# Altium project ART-Pi_STM32H750_COPY.PrjPcb (part 1 of 2)
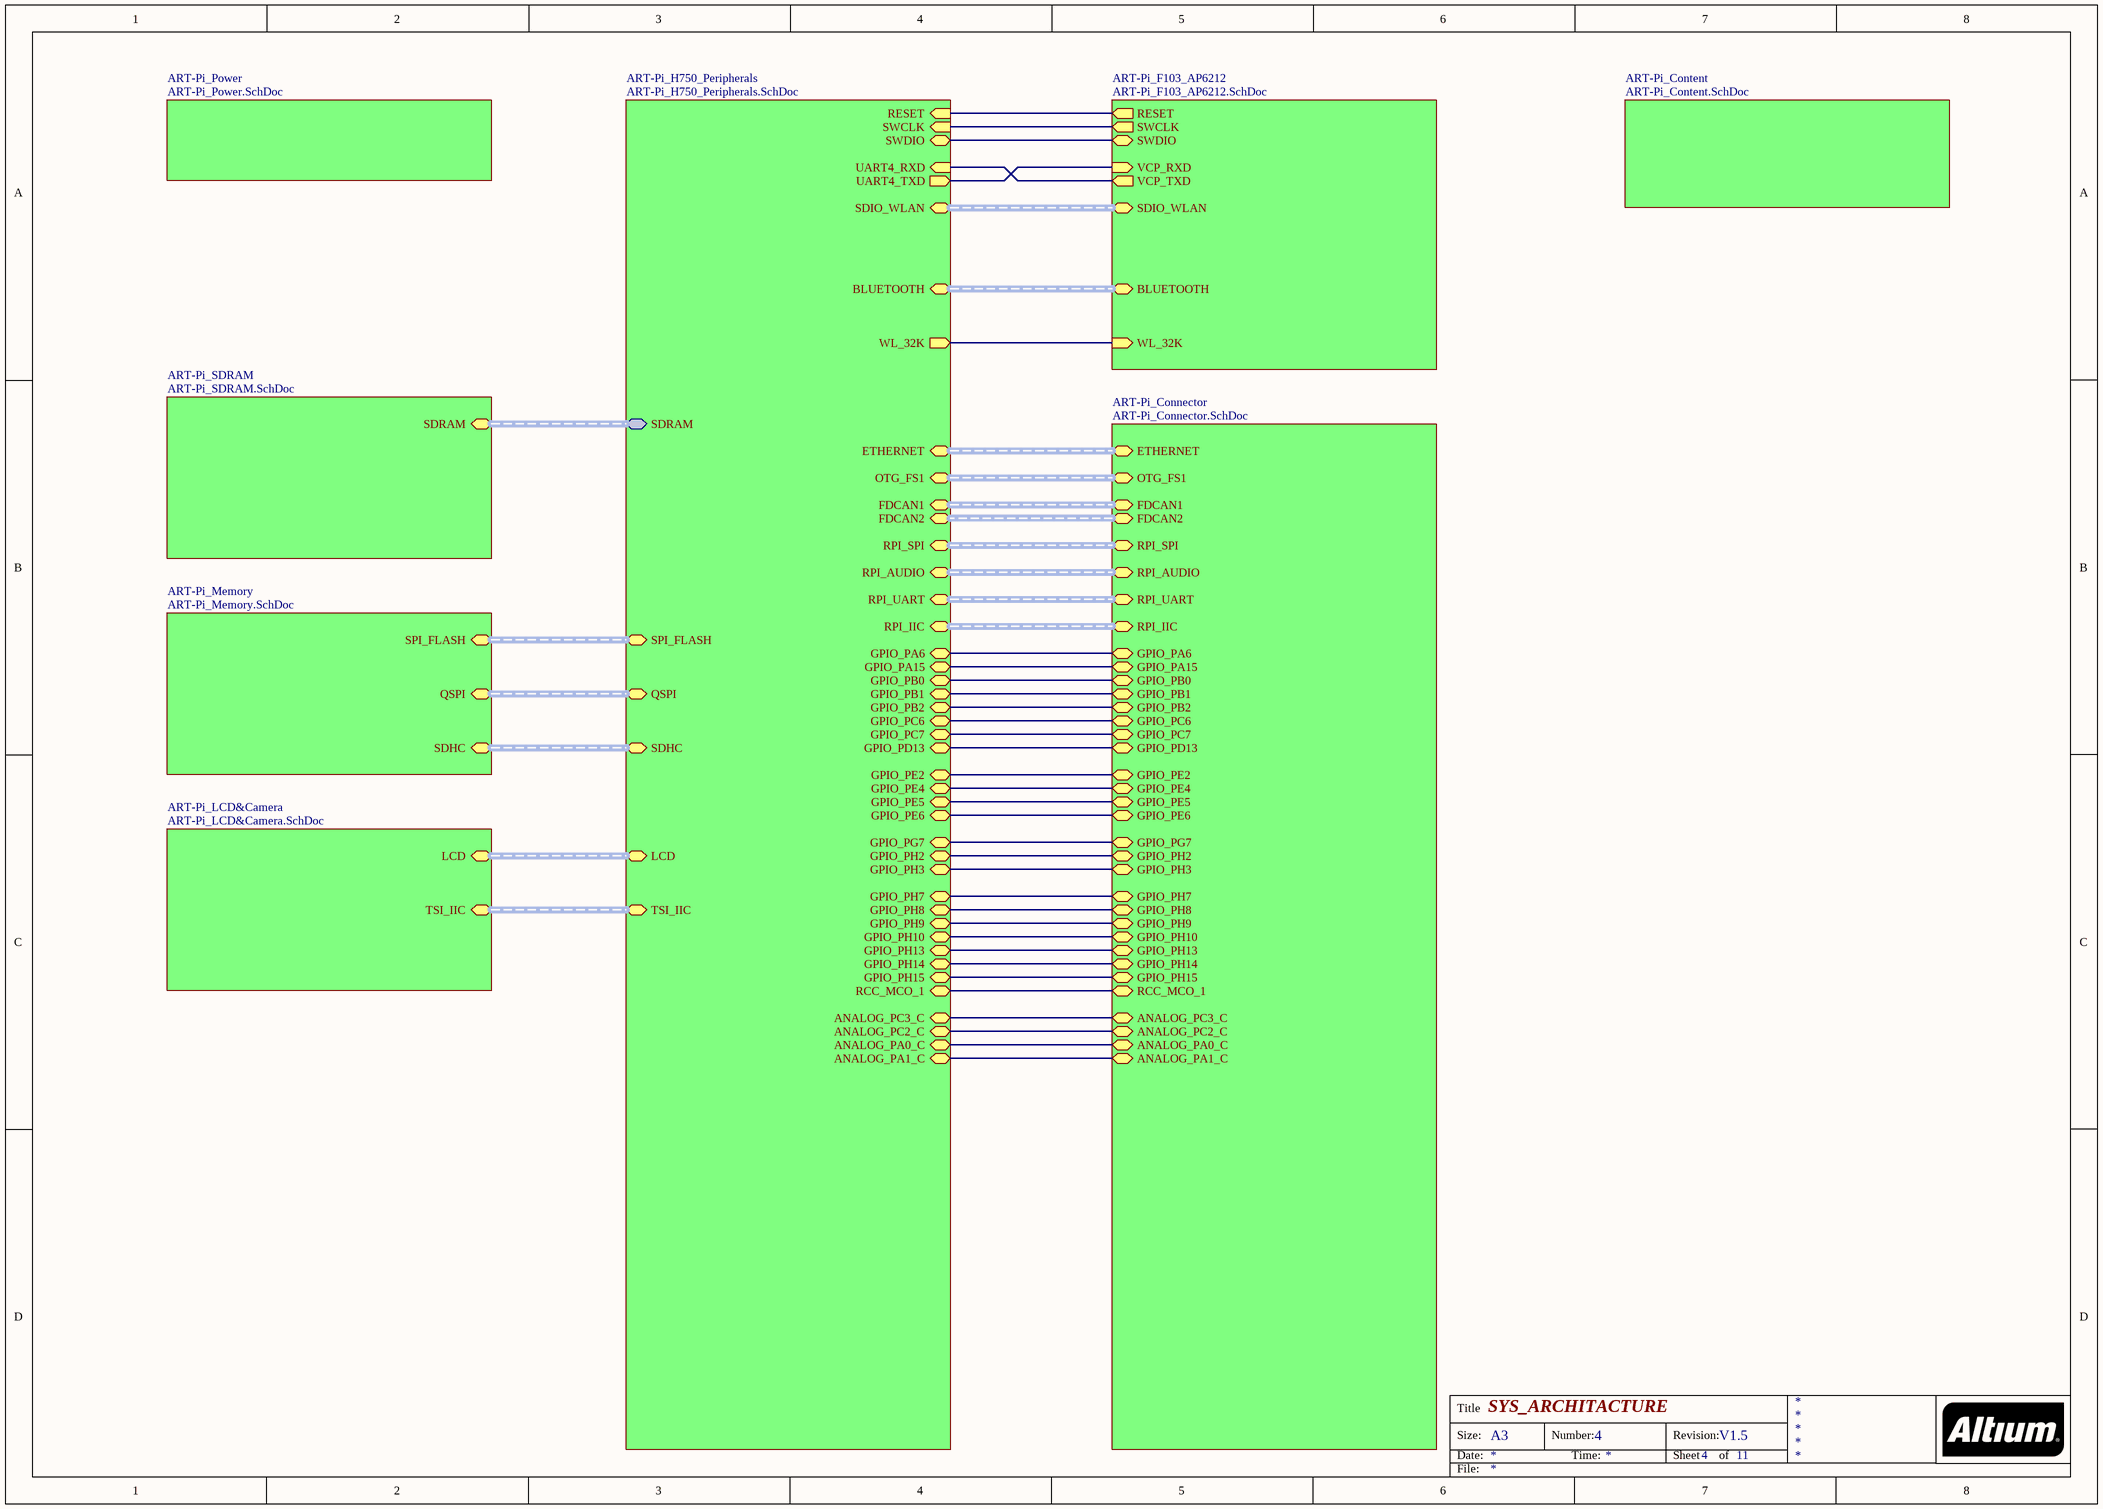
[diagram p0: SYS_ARCHITACTURE.SchDoc]
9 sheets, 195 parts. Net scope: global (net labels, ports and power ports of the same name join across sheets).
Board file: ART-Pi_STM32H750_COPY.PcbDoc
Sheets:
  SYS_ARCHITACTURE.SchDoc
    ART-Pi_Power = ART-Pi_Power.SchDoc
    ART-Pi_SDRAM = ART-Pi_SDRAM.SchDoc
    ART-Pi_Memory = ART-Pi_Memory.SchDoc
    ART-Pi_LCD&Camera = ART-Pi_LCD&Camera.SchDoc
    ART-Pi_H750_Peripherals = ART-Pi_H750_Peripherals.SchDoc
    ART-Pi_F103_AP6212 = ART-Pi_F103_AP6212.SchDoc
    ART-Pi_Content = ART-Pi_Content.SchDoc
    ART-Pi_Connector = ART-Pi_Connector.SchDoc

## Sheet SYS_ARCHITACTURE.SchDoc: SYS_ARCHITACTURE
size A3; DocumentNumber: 4; Revision: V1.5; SheetNumber: 4; SheetTotal: 11; PageSetup: Record=PageOptions|CenterHorizontal=True|CenterVertical=True|PrintScale=1.01|XCorrection=1.00|YCorrection=1.00|PrintKind=0|BorderSize=5000000|LeftOffset=0|BottomOffset=0|Orientation=2|PaperLength=1000|PaperWidth=1000|Scale=100|PaperSource=7|PrintQuality=600|MediaType=1|DitherType=10|PrintScaleMode=1|PaperKind=A3(297x420mm)|PaperIndex=8

### Sub-sheets
ART-Pi_Connector = ART-Pi_Connector.SchDoc: OTG_FS1 (harness Harness), FDCAN1 (harness Harness), FDCAN2 (harness Harness), RPI_SPI (harness Harness), RPI_UART (harness Harness), RPI_IIC (harness Harness), GPIO_PA6, GPIO_PA15, GPIO_PB0, GPIO_PB1, GPIO_PB2, GPIO_PC6, GPIO_PC7, GPIO_PD13, GPIO_PE2, GPIO_PE5, GPIO_PE4, GPIO_PE6, GPIO_PG7, GPIO_PH2, GPIO_PH3, GPIO_PH7, GPIO_PH8, GPIO_PH9, GPIO_PH10, GPIO_PH13, GPIO_PH14, GPIO_PH15, RCC_MCO_1, ANALOG_PC3_C, ANALOG_PC2_C, ANALOG_PA0_C, ANALOG_PA1_C, ETHERNET (harness Harness), RPI_AUDIO (harness Harness)
ART-Pi_Content = ART-Pi_Content.SchDoc: no entries
ART-Pi_F103_AP6212 = ART-Pi_F103_AP6212.SchDoc: RESET (out), SWCLK (out), SWDIO (bidir), VCP_RXD (in), VCP_TXD (out), SDIO_WLAN (harness Harness), BLUETOOTH (harness Harness), WL_32K (in)
ART-Pi_H750_Peripherals = ART-Pi_H750_Peripherals.SchDoc: SDRAM (harness Harness), SPI_FLASH (harness Harness), QSPI (harness Harness), SDHC (harness Harness), LCD (harness Harness), TSI_IIC (harness Harness), RESET (in), SWCLK (in), SWDIO (bidir), UART4_RXD (in), UART4_TXD (out), SDIO_WLAN (harness Harness), BLUETOOTH (harness Harness), WL_32K (out), ETHERNET (harness Harness), OTG_FS1 (harness Harness), FDCAN1 (harness Harness), FDCAN2 (harness Harness), RPI_SPI (harness Harness), RPI_UART (harness Harness), RPI_IIC (harness Harness), GPIO_PA6, GPIO_PA15, GPIO_PB0, GPIO_PB1, GPIO_PB2, GPIO_PC6, GPIO_PC7, GPIO_PD13, GPIO_PE2, GPIO_PE5, GPIO_PE4, GPIO_PE6, GPIO_PG7, GPIO_PH2, GPIO_PH3, GPIO_PH7, GPIO_PH8, GPIO_PH9, GPIO_PH10, GPIO_PH13, GPIO_PH14, GPIO_PH15, RCC_MCO_1, ANALOG_PC3_C, ANALOG_PC2_C, ANALOG_PA0_C, ANALOG_PA1_C, RPI_AUDIO (harness Harness)
ART-Pi_LCD&Camera = ART-Pi_LCD&Camera.SchDoc: LCD (harness Harness), TSI_IIC (harness Harness)
ART-Pi_Memory = ART-Pi_Memory.SchDoc: SPI_FLASH (harness Harness), QSPI (harness Harness), SDHC (harness Harness)
ART-Pi_Power = ART-Pi_Power.SchDoc: no entries
ART-Pi_SDRAM = ART-Pi_SDRAM.SchDoc: SDRAM (harness Harness)

### Nets
(unnamed): sheet ART-Pi_H750_Peripherals/RESET, sheet ART-Pi_F103_AP6212/RESET
(unnamed): sheet ART-Pi_H750_Peripherals/SWCLK, sheet ART-Pi_F103_AP6212/SWCLK
(unnamed): sheet ART-Pi_H750_Peripherals/SWDIO, sheet ART-Pi_F103_AP6212/SWDIO
(unnamed): sheet ART-Pi_H750_Peripherals/UART4_RXD, sheet ART-Pi_F103_AP6212/VCP_TXD
(unnamed): sheet ART-Pi_H750_Peripherals/UART4_TXD, sheet ART-Pi_F103_AP6212/VCP_RXD
(unnamed): sheet ART-Pi_H750_Peripherals/WL_32K, sheet ART-Pi_F103_AP6212/WL_32K
(unnamed): sheet ART-Pi_H750_Peripherals/GPIO_PA6, sheet ART-Pi_Connector/GPIO_PA6
(unnamed): sheet ART-Pi_H750_Peripherals/GPIO_PA15, sheet ART-Pi_Connector/GPIO_PA15
(unnamed): sheet ART-Pi_H750_Peripherals/GPIO_PB0, sheet ART-Pi_Connector/GPIO_PB0
(unnamed): sheet ART-Pi_H750_Peripherals/GPIO_PB1, sheet ART-Pi_Connector/GPIO_PB1
(unnamed): sheet ART-Pi_H750_Peripherals/GPIO_PB2, sheet ART-Pi_Connector/GPIO_PB2
(unnamed): sheet ART-Pi_H750_Peripherals/GPIO_PC6, sheet ART-Pi_Connector/GPIO_PC6
(unnamed): sheet ART-Pi_H750_Peripherals/GPIO_PC7, sheet ART-Pi_Connector/GPIO_PC7
(unnamed): sheet ART-Pi_H750_Peripherals/GPIO_PD13, sheet ART-Pi_Connector/GPIO_PD13
(unnamed): sheet ART-Pi_H750_Peripherals/GPIO_PE2, sheet ART-Pi_Connector/GPIO_PE2
(unnamed): sheet ART-Pi_H750_Peripherals/GPIO_PE5, sheet ART-Pi_Connector/GPIO_PE5
(unnamed): sheet ART-Pi_H750_Peripherals/GPIO_PE4, sheet ART-Pi_Connector/GPIO_PE4
(unnamed): sheet ART-Pi_H750_Peripherals/GPIO_PE6, sheet ART-Pi_Connector/GPIO_PE6
(unnamed): sheet ART-Pi_H750_Peripherals/GPIO_PG7, sheet ART-Pi_Connector/GPIO_PG7
(unnamed): sheet ART-Pi_H750_Peripherals/GPIO_PH2, sheet ART-Pi_Connector/GPIO_PH2
(unnamed): sheet ART-Pi_H750_Peripherals/GPIO_PH3, sheet ART-Pi_Connector/GPIO_PH3
(unnamed): sheet ART-Pi_H750_Peripherals/GPIO_PH7, sheet ART-Pi_Connector/GPIO_PH7
(unnamed): sheet ART-Pi_H750_Peripherals/GPIO_PH8, sheet ART-Pi_Connector/GPIO_PH8
(unnamed): sheet ART-Pi_H750_Peripherals/GPIO_PH9, sheet ART-Pi_Connector/GPIO_PH9
(unnamed): sheet ART-Pi_H750_Peripherals/GPIO_PH10, sheet ART-Pi_Connector/GPIO_PH10
(unnamed): sheet ART-Pi_H750_Peripherals/GPIO_PH13, sheet ART-Pi_Connector/GPIO_PH13
(unnamed): sheet ART-Pi_H750_Peripherals/GPIO_PH14, sheet ART-Pi_Connector/GPIO_PH14
(unnamed): sheet ART-Pi_H750_Peripherals/GPIO_PH15, sheet ART-Pi_Connector/GPIO_PH15
(unnamed): sheet ART-Pi_H750_Peripherals/RCC_MCO_1, sheet ART-Pi_Connector/RCC_MCO_1
(unnamed): sheet ART-Pi_H750_Peripherals/ANALOG_PC3_C, sheet ART-Pi_Connector/ANALOG_PC3_C
(unnamed): sheet ART-Pi_H750_Peripherals/ANALOG_PC2_C, sheet ART-Pi_Connector/ANALOG_PC2_C
(unnamed): sheet ART-Pi_H750_Peripherals/ANALOG_PA0_C, sheet ART-Pi_Connector/ANALOG_PA0_C
(unnamed): sheet ART-Pi_H750_Peripherals/ANALOG_PA1_C, sheet ART-Pi_Connector/ANALOG_PA1_C

### Buses and harness runs
harness sheet ART-Pi_Connector/ETHERNET = sheet ART-Pi_H750_Peripherals/ETHERNET
harness sheet ART-Pi_Connector/FDCAN1 = sheet ART-Pi_H750_Peripherals/FDCAN1
harness sheet ART-Pi_Connector/FDCAN2 = sheet ART-Pi_H750_Peripherals/FDCAN2
harness sheet ART-Pi_Connector/OTG_FS1 = sheet ART-Pi_H750_Peripherals/OTG_FS1
harness sheet ART-Pi_Connector/RPI_AUDIO = sheet ART-Pi_H750_Peripherals/RPI_AUDIO
harness sheet ART-Pi_Connector/RPI_IIC = sheet ART-Pi_H750_Peripherals/RPI_IIC
harness sheet ART-Pi_Connector/RPI_SPI = sheet ART-Pi_H750_Peripherals/RPI_SPI
harness sheet ART-Pi_Connector/RPI_UART = sheet ART-Pi_H750_Peripherals/RPI_UART
harness sheet ART-Pi_F103_AP6212/BLUETOOTH = sheet ART-Pi_H750_Peripherals/BLUETOOTH
harness sheet ART-Pi_F103_AP6212/SDIO_WLAN = sheet ART-Pi_H750_Peripherals/SDIO_WLAN
harness sheet ART-Pi_H750_Peripherals/LCD = sheet ART-Pi_LCD&Camera/LCD
harness sheet ART-Pi_H750_Peripherals/QSPI = sheet ART-Pi_Memory/QSPI
harness sheet ART-Pi_H750_Peripherals/SDHC = sheet ART-Pi_Memory/SDHC
harness sheet ART-Pi_H750_Peripherals/SDRAM = sheet ART-Pi_SDRAM/SDRAM
harness sheet ART-Pi_H750_Peripherals/SPI_FLASH = sheet ART-Pi_Memory/SPI_FLASH
harness sheet ART-Pi_H750_Peripherals/TSI_IIC = sheet ART-Pi_LCD&Camera/TSI_IIC

### Notes on the sheet
- Title
- Size:
- Date:
- A3
- Number:
- Time:
- Revision:
- Sheet
- of
- File:

## Sheet ART-Pi_Power.SchDoc: POWER_Distribution
size A3; DocumentNumber: 5; Revision: V1.5; SheetNumber: 5; SheetTotal: 11; PageSetup: Record=PageOptions|CenterHorizontal=True|CenterVertical=True|PrintScale=1.01|XCorrection=1.00|YCorrection=1.00|PrintKind=0|BorderSize=5000000|LeftOffset=0|BottomOffset=0|Orientation=2|PaperLength=1000|PaperWidth=1000|Scale=100|PaperSource=7|PrintQuality=600|MediaType=1|DitherType=10|PrintScaleMode=1|PaperKind=A3(297x420mm)|PaperIndex=8
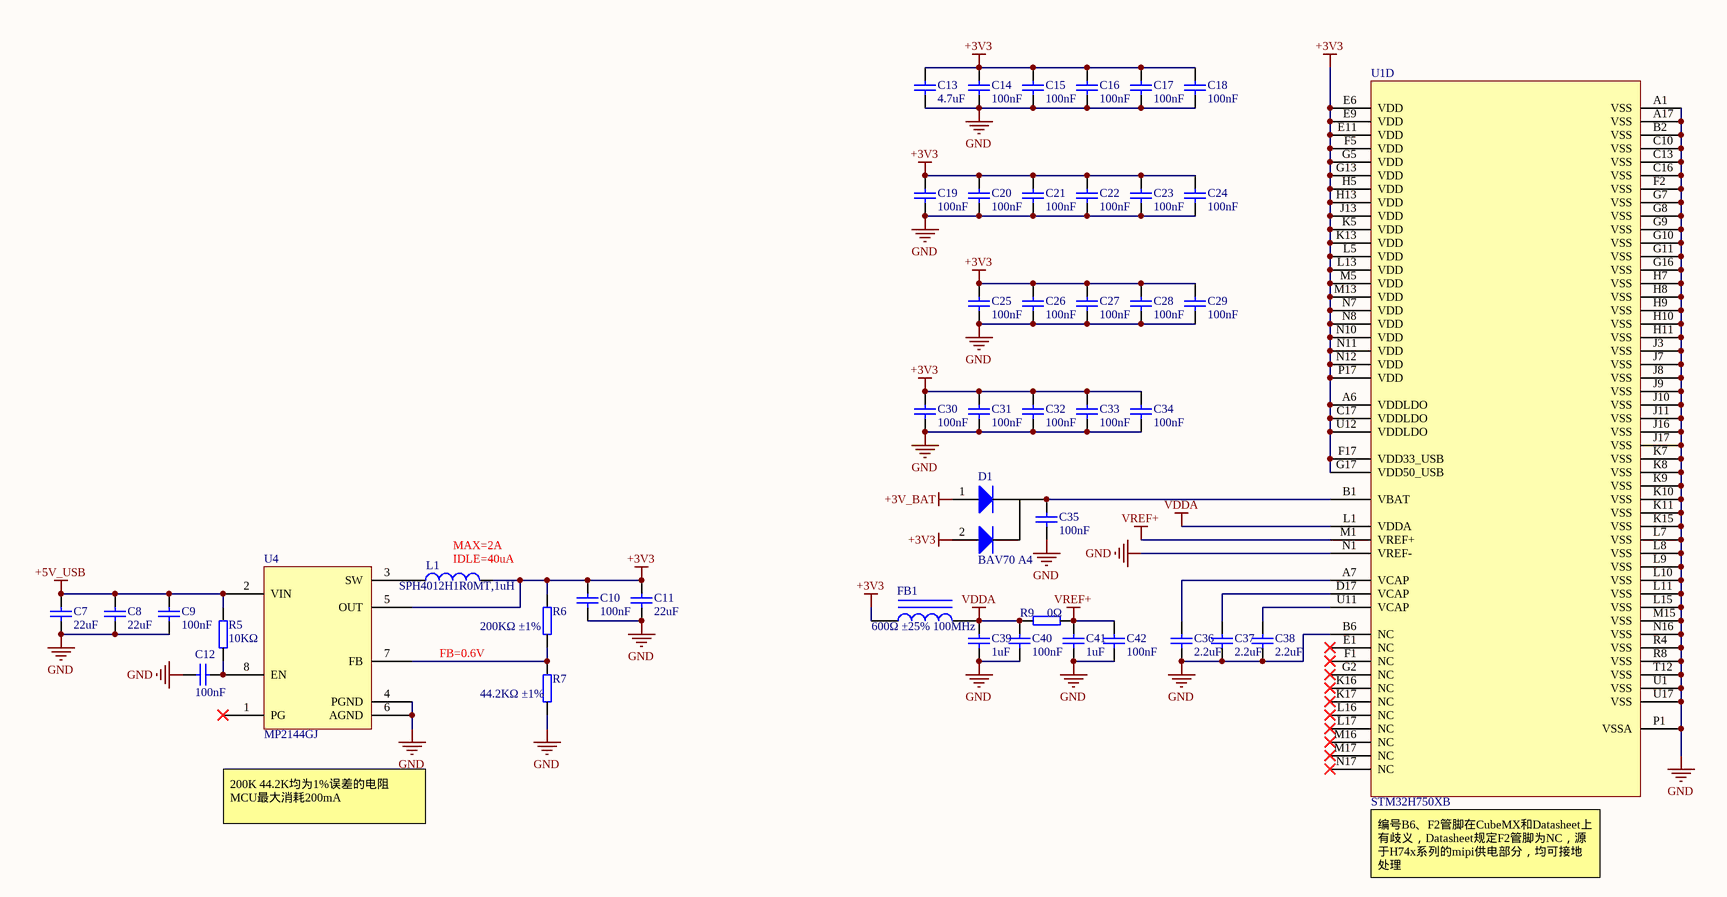
[diagram p1: ART-Pi_Power.SchDoc]

### Parts
C7  22uF  [0603_C]
C8  22uF  [0603_C]
C9  100nF  [0402_C]
C10  100nF  [0402_C]
C11  22uF  [0603_C]
C12  100nF  [0402_C]
C13  4.7uF  [0402_C]
C14  100nF  [0402_C]
C15  100nF  [0402_C]
C16  100nF  [0402_C]
C17  100nF  [0402_C]
C18  100nF  [0402_C]
C19  100nF  [0402_C]
C20  100nF  [0402_C]
C21  100nF  [0402_C]
C22  100nF  [0402_C]
C23  100nF  [0402_C]
C24  100nF  [0402_C]
C25  100nF  [0402_C]
C26  100nF  [0402_C]
C27  100nF  [0402_C]
C28  100nF  [0402_C]
C29  100nF  [0402_C]
C30  100nF  [0402_C]
C31  100nF  [0402_C]
C32  100nF  [0402_C]
C33  100nF  [0402_C]
C34  100nF  [0402_C]
C35  100nF  [0402_C]
C36  2.2uF  [0402_C]
C37  2.2uF  [0402_C]
C38  2.2uF  [0402_C]
C39  1uF  [0402_C]
C40  100nF  [0402_C]
C41  1uF  [0402_C]
C42  100nF  [0402_C]
D1  BAV70 A4  [SOT23_P]
FB1  value 600Ω ±25% 100MHz  [0402_R]  (hidden comment: Inductor Iron)
L1  SPH4012H1R0MT,1uH  [SPH4012H1R0MT]
R5  10KΩ  [0402_R]
R6  200KΩ ±1%  [0402_R]
R7  44.2KΩ ±1%  [0402_R]
R9  0Ω  [0402_R]
U1  STM32H750XB  [TFBGA240+25]  (part D of 4)
U4  MP2144GJ  [TSOP23-8]

### Nets
+3V3: C10.2 C11.2 C13.2 C14.2 C15.2 C16.2 C17.2 C18.2 C19.2 C20.2 C21.2 C22.2 C23.2 C24.2 C25.2 C26.2 C27.2 C28.2 C29.2 C30.2 C31.2 C32.2 C33.2 C34.2 D1.2 FB1.1 L1.2 R6.2 U1.A6(VDDLDO) U1.C17(VDDLDO) U1.E6(VDD) U1.E9(VDD) U1.E11(VDD) U1.F5(VDD) U1.F17(VDD33_USB) U1.G5(VDD) U1.G13(VDD) U1.G17(VDD50_USB) U1.H5(VDD) U1.H13(VDD) U1.J13(VDD) U1.K5(VDD) U1.K13(VDD) U1.L5(VDD) U1.L13(VDD) U1.M5(VDD) U1.M13(VDD) U1.N7(VDD) U1.N8(VDD) U1.N10(VDD) U1.N11(VDD) U1.N12(VDD) U1.P17(VDD) U1.U12(VDDLDO) U4.5(OUT)
+3V_BAT: D1.1
+5V_USB: C7.2 C8.2 C9.2 R5.2 U4.2(VIN)
GND: C7.1 C8.1 C9.1 C10.1 C11.1 C12.2 C13.1 C14.1 C15.1 C16.1 C17.1 C18.1 C19.1 C20.1 C21.1 C22.1 C23.1 C24.1 C25.1 C26.1 C27.1 C28.1 C29.1 C30.1 C31.1 C32.1 C33.1 C34.1 C35.1 C36.1 C37.1 C38.1 C39.1 C40.1 C41.1 C42.1 R7.1 U1.A1(VSS) U1.A17(VSS) U1.B2(VSS) U1.B6(NC) U1.C10(VSS) U1.C13(VSS) U1.C16(VSS) U1.F2(VSS) U1.G7(VSS) U1.G8(VSS) U1.G9(VSS) U1.G10(VSS) U1.G11(VSS) U1.G16(VSS) U1.H7(VSS) U1.H8(VSS) U1.H9(VSS) U1.H10(VSS) U1.H11(VSS) U1.J3(VSS) U1.J7(VSS) U1.J8(VSS) U1.J9(VSS) U1.J10(VSS) U1.J11(VSS) U1.J16(VSS) U1.J17(VSS) U1.K7(VSS) U1.K8(VSS) U1.K9(VSS) U1.K10(VSS) U1.K11(VSS) U1.K15(VSS) U1.L7(VSS) U1.L8(VSS) U1.L9(VSS) U1.L10(VSS) U1.L11(VSS) U1.L15(VSS) U1.M15(VSS) U1.N1(VREF-) U1.N16(VSS) U1.P1(VSSA) U1.R4(VSS) U1.R8(VSS) U1.T12(VSS) U1.U1(VSS) U1.U17(VSS) U4.4(PGND) U4.6(AGND)
VDDA: C39.2 C40.2 FB1.2 R9.2 U1.L1(VDDA)
VREF+: C41.2 C42.2 R9.1 U1.M1(VREF+)
NetC12_1: C12.1 R5.1 U4.8(EN)
NetC35_2: C35.2 D1.3 U1.B1(VBAT)
NetC36_2: C36.2 U1.A7(VCAP)
NetC37_2: C37.2 U1.D17(VCAP)
NetC38_2: C38.2 U1.U11(VCAP)
NetL1_1: L1.1 U4.3(SW)
NetR6_1: R6.1 R7.2 U4.7(FB)

Not connected (* = marked no-connect by the designer): U1 E1(NC)* F1(NC)* G2(NC)* K16(NC)* K17(NC)* L16(NC)* L17(NC)* M16(NC)* M17(NC)* N17(NC)*; U4 1(PG)*

### Notes on the sheet
- (near L1) MAX=2A
- (near L1) IDLE=40uA
- FB=0.6V
- 200K 44.2K均为1%误差的电阻
  MCU最大消耗200mA
- (near U1) 编号B6、F2管脚在CubeMX和Datasheet上有歧义，Datasheet规定F2管脚为NC，源于H74x系列的mipi供电部分，均可接地处理
- Title
- Size:
- Date:
- A3
- Number:
- Time:
- Revision:
- Sheet
- of
- File:

### Library data of the parts
C7-C42 = Cap: Capacitor; Published: 8-Jun-2000; LatestRevisionDate: 17-Jul-2002; LatestRevisionNote: Re-released for DXP Platform.; PackageReference: RAD-0.3; Publisher: Altium Limited; PackageDescription: Radial Cap, Thru-Hole; 2 Leads; 0.3 in Pin Spacing
FB1 = Inductor Iron: Magnetic-Core Inductor; Published: 24-Mar-1999; LatestRevisionDate: 17-Jul-2002; LatestRevisionNote: Re-released for DXP Platform.; PackageReference: AXIAL-0.9; Publisher: Altium Limited; PackageDescription: Axial Device, Thru-Hole; 2 Leads; 0.9 in Pin Spacing
L1 = Inductor: Code_IEC: 1005; Value: 10mH; Published: 8-Jun-2000; LatestRevisionDate: 29-May-2009; LatestRevisionNote: IPC-7351 Footprint Added.; PackageReference: 0402-A; Publisher: Altium Limited; PackageDescription: Chip Inductor; Code_JEITA: 0402
R5-R7 R9 = Res: Resister

## Sheet ART-Pi_SDRAM.SchDoc: SDRAM_CFG
size A3; DocumentNumber: 7; Revision: V1.5; SheetNumber: 7; SheetTotal: 11; PageSetup: Record=PageOptions|CenterHorizontal=True|CenterVertical=True|PrintScale=1.01|XCorrection=1.00|YCorrection=1.00|PrintKind=0|BorderSize=5000000|LeftOffset=0|BottomOffset=0|Orientation=2|PaperLength=1000|PaperWidth=1000|Scale=100|PaperSource=7|PrintQuality=600|MediaType=1|DitherType=10|PrintScaleMode=1|PaperKind=A3(297x420mm)|PaperIndex=8
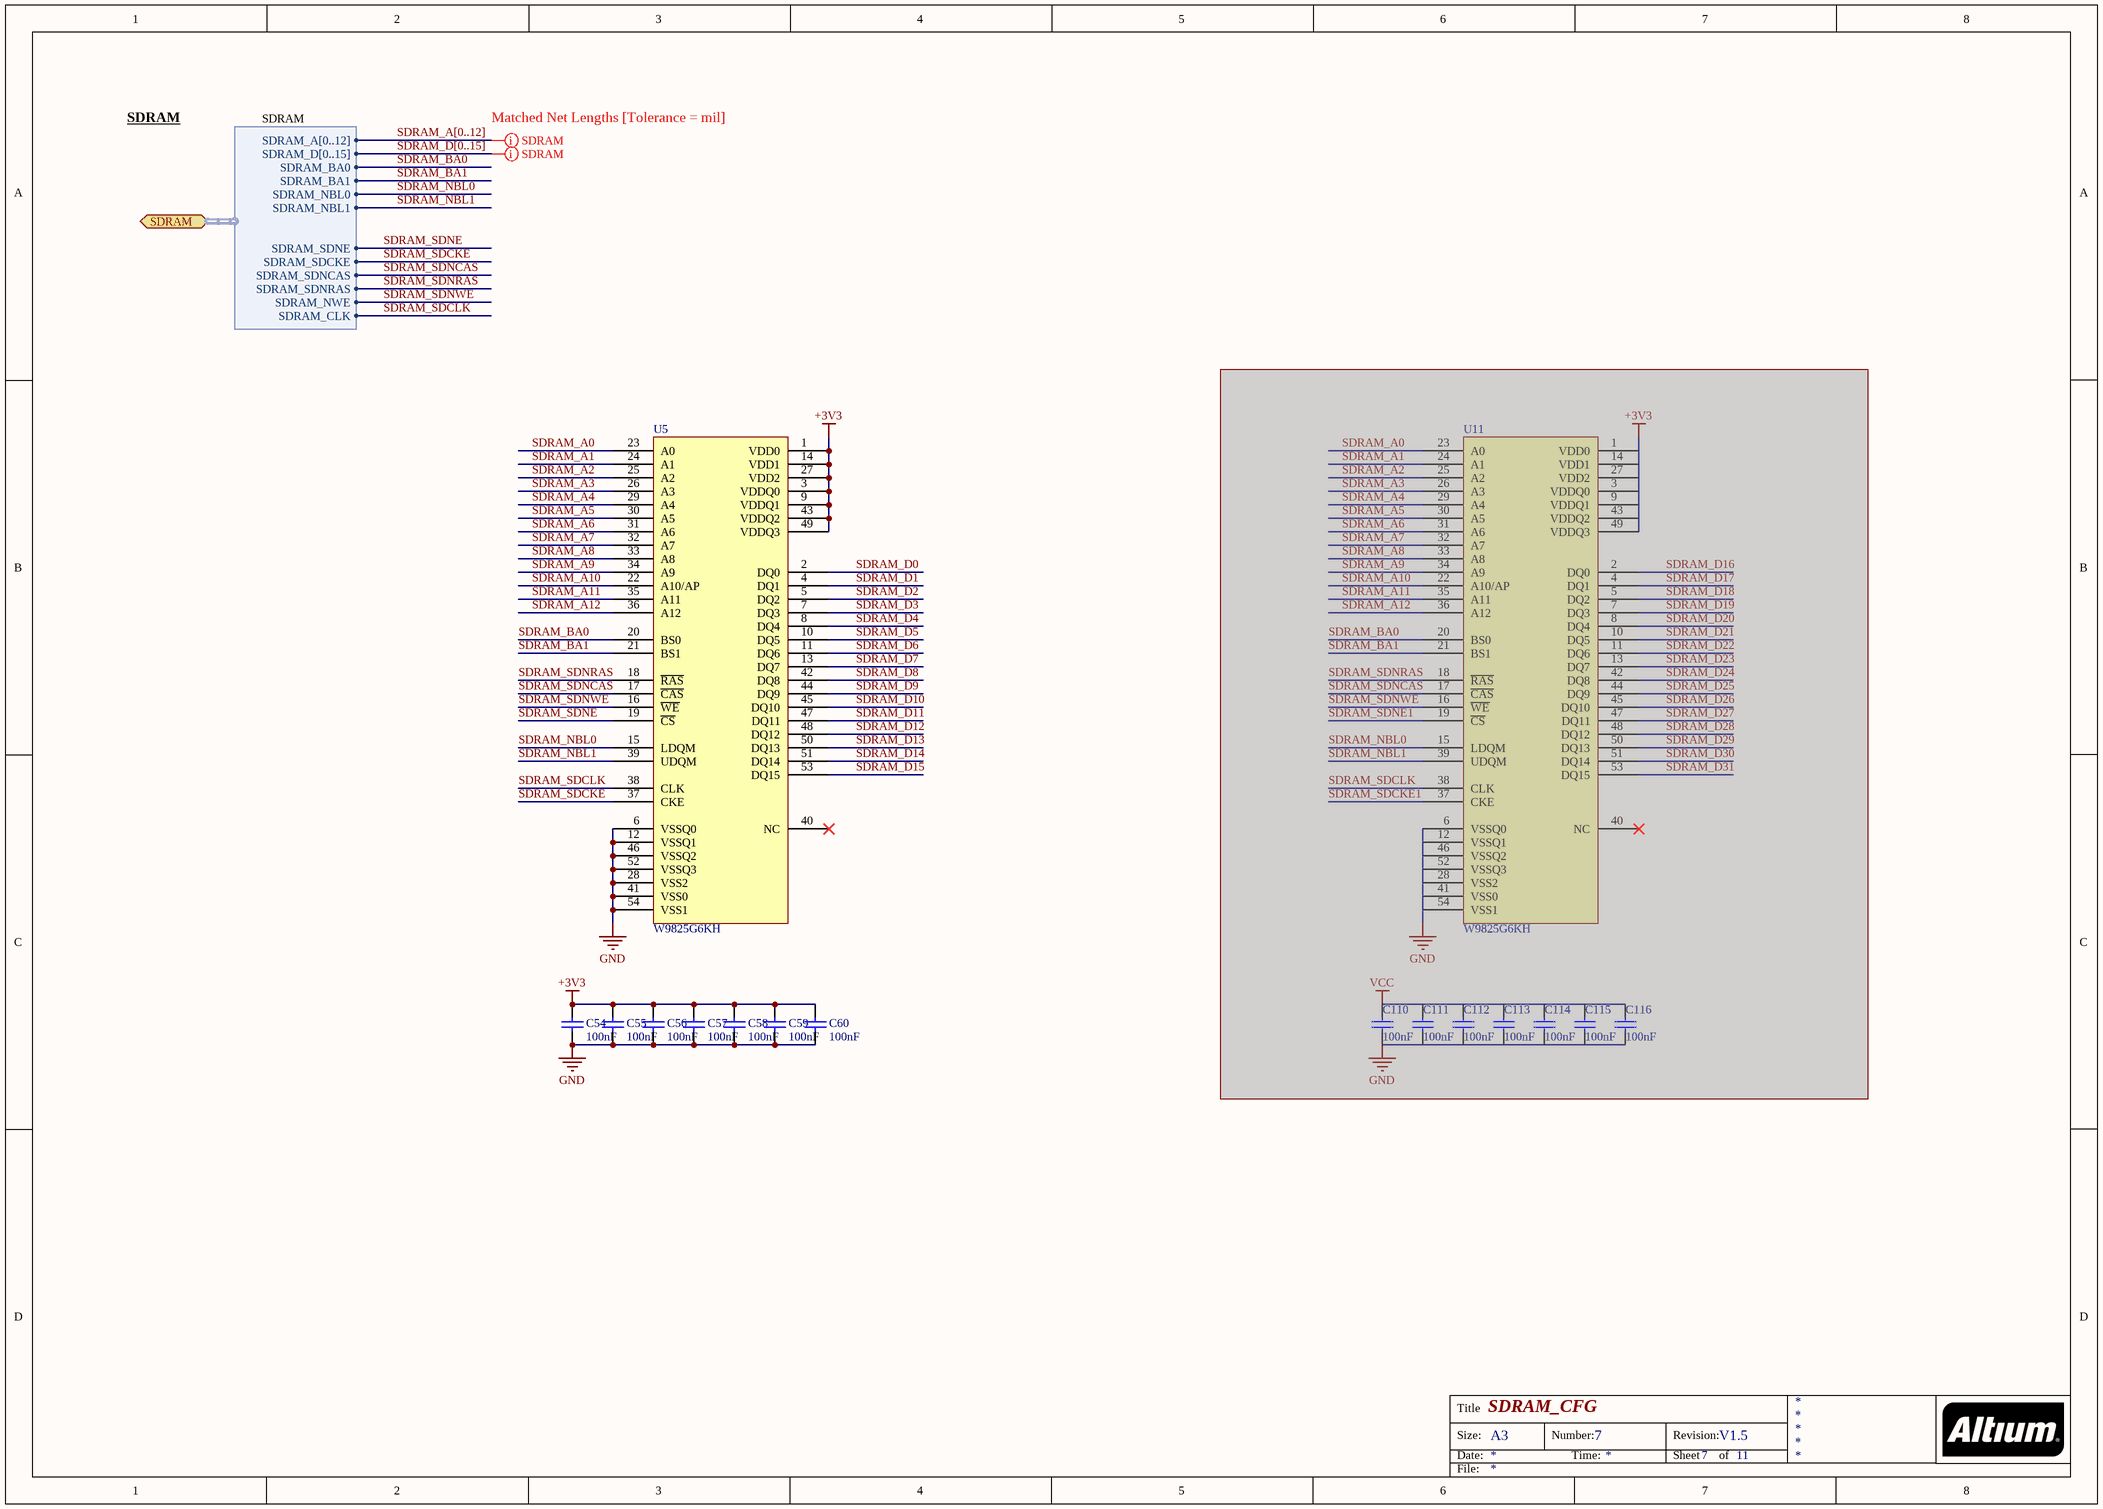
[diagram p2: ART-Pi_SDRAM.SchDoc]

### Parts
C54  100nF  [0402_C]
C55  100nF  [0402_C]
C56  100nF  [0402_C]
C57  100nF  [0402_C]
C58  100nF  [0402_C]
C59  100nF  [0402_C]
C60  100nF  [0402_C]
C110  100nF  [0402_C]  (masked out: inside a compile mask, not in the netlist)
C111  100nF  [0402_C]  (masked out: inside a compile mask, not in the netlist)
C112  100nF  [0402_C]  (masked out: inside a compile mask, not in the netlist)
C113  100nF  [0402_C]  (masked out: inside a compile mask, not in the netlist)
C114  100nF  [0402_C]  (masked out: inside a compile mask, not in the netlist)
C115  100nF  [0402_C]  (masked out: inside a compile mask, not in the netlist)
C116  100nF  [0402_C]  (masked out: inside a compile mask, not in the netlist)
U5  W9825G6KH  [TSOP54]
U11  W9825G6KH  [TSOP54]  (masked out: inside a compile mask, not in the netlist)

### Ports
SDRAM (harness Harness)

### Harnesses
Harness: SDRAM_A[0..12], SDRAM_D[0..15], SDRAM_BA0, SDRAM_BA1, SDRAM_NBL0, SDRAM_NBL1, SDRAM_SDNE, SDRAM_SDCKE, SDRAM_SDNCAS, SDRAM_SDNRAS, SDRAM_NWE, SDRAM_CLK

### Nets
+3V3: C54.2 C55.2 C56.2 C57.2 C58.2 C59.2 C60.2 U5.1(VDD0) U5.3(VDDQ0) U5.9(VDDQ1) U5.14(VDD1) U5.27(VDD2) U5.43(VDDQ2) U5.49(VDDQ3)
GND: C54.1 C55.1 C56.1 C57.1 C58.1 C59.1 C60.1 U5.6(VSSQ0) U5.12(VSSQ1) U5.28(VSS2) U5.41(VSS0) U5.46(VSSQ2) U5.52(VSSQ3) U5.54(VSS1)
SDRAM_A0: U5.23(A0)  [project net FMC_A0]
SDRAM_A1: U5.24(A1)  [project net FMC_A1]
SDRAM_A2: U5.25(A2)  [project net FMC_A2]
SDRAM_A3: U5.26(A3)  [project net FMC_A3]
SDRAM_A4: U5.29(A4)  [project net FMC_A4]
SDRAM_A5: U5.30(A5)  [project net FMC_A5]
SDRAM_A6: U5.31(A6)  [project net FMC_A6]
SDRAM_A7: U5.32(A7)  [project net FMC_A7]
SDRAM_A8: U5.33(A8)  [project net FMC_A8]
SDRAM_A9: U5.34(A9)  [project net FMC_A9]
SDRAM_A10: U5.22(A10/AP)  [project net FMC_A10]
SDRAM_A11: U5.35(A11)  [project net FMC_A11]
SDRAM_A12: U5.36(A12)  [project net FMC_A12]
SDRAM_BA0: U5.20(BS0) ; port SDRAM.SDRAM_BA0  [project net FMC_BA0]
SDRAM_BA1: U5.21(BS1) ; port SDRAM.SDRAM_BA1  [project net FMC_BA1]
SDRAM_D0: U5.2(DQ0)  [project net FMC_D0]
SDRAM_D1: U5.4(DQ1)  [project net FMC_D1]
SDRAM_D2: U5.5(DQ2)  [project net FMC_D2]
SDRAM_D3: U5.7(DQ3)  [project net FMC_D3]
SDRAM_D4: U5.8(DQ4)  [project net FMC_D4]
SDRAM_D5: U5.10(DQ5)  [project net FMC_D5]
SDRAM_D6: U5.11(DQ6)  [project net FMC_D6]
SDRAM_D7: U5.13(DQ7)  [project net FMC_D7]
SDRAM_D8: U5.42(DQ8)  [project net FMC_D8]
SDRAM_D9: U5.44(DQ9)  [project net FMC_D9]
SDRAM_D10: U5.45(DQ10)  [project net FMC_D10]
SDRAM_D11: U5.47(DQ11)  [project net FMC_D11]
SDRAM_D12: U5.48(DQ12)  [project net FMC_D12]
SDRAM_D13: U5.50(DQ13)  [project net FMC_D13]
SDRAM_D14: U5.51(DQ14)  [project net FMC_D14]
SDRAM_D15: U5.53(DQ15)  [project net FMC_D15]
SDRAM_NBL0: U5.15(LDQM) ; port SDRAM.SDRAM_NBL0  [project net FMC_NBL0]
SDRAM_NBL1: U5.39(UDQM) ; port SDRAM.SDRAM_NBL1  [project net FMC_NBL1]
SDRAM_SDCKE: U5.37(CKE) ; port SDRAM.SDRAM_SDCKE  [project net FMC_SDCKE0]
SDRAM_SDCLK: U5.38(CLK) ; port SDRAM.SDRAM_CLK  [project net FMC_SDCLK]
SDRAM_SDNCAS: U5.17(~{CAS}) ; port SDRAM.SDRAM_SDNCAS  [project net FMC_SDNCAS]
SDRAM_SDNE: U5.19(~{CS}) ; port SDRAM.SDRAM_SDNE  [project net FMC_SDNE0]
SDRAM_SDNRAS: U5.18(~{RAS}) ; port SDRAM.SDRAM_SDNRAS  [project net FMC_SDNRAS]
SDRAM_SDNWE: U5.16(~{WE}) ; port SDRAM.SDRAM_NWE  [project net FMC_SDNWE]

Not connected (* = marked no-connect by the designer): U5 40(NC)*

### Buses and harness runs
bus SDRAM_A[0..12]
bus SDRAM_D[0..15]

### Layout directives
rule Undefined: (no net found under the mark)

### Notes on the sheet
- SDRAM
- Matched Net Lengths [Tolerance = mil]
- Title
- Size:
- Date:
- A3
- Number:
- Time:
- Revision:
- Sheet
- of
- File:

### Library data of the parts
C54-C60 C110-C116 = Cap: Capacitor; Published: 8-Jun-2000; LatestRevisionDate: 17-Jul-2002; LatestRevisionNote: Re-released for DXP Platform.; PackageReference: RAD-0.3; Publisher: Altium Limited; PackageDescription: Radial Cap, Thru-Hole; 2 Leads; 0.3 in Pin Spacing
U5 U11 = W9825G6KH: 32MB SDRAM

## Sheet ART-Pi_Memory.SchDoc: MOMERY_CFG
size A3; DocumentNumber: 8; Revision: V1.5; SheetNumber: 8; SheetTotal: 11; PageSetup: Record=PageOptions|CenterHorizontal=True|CenterVertical=True|PrintScale=1.01|XCorrection=1.00|YCorrection=1.00|PrintKind=0|BorderSize=5000000|LeftOffset=0|BottomOffset=0|Orientation=2|PaperLength=1000|PaperWidth=1000|Scale=100|PaperSource=7|PrintQuality=600|MediaType=1|DitherType=10|PrintScaleMode=1|PaperKind=A3(297x420mm)|PaperIndex=8
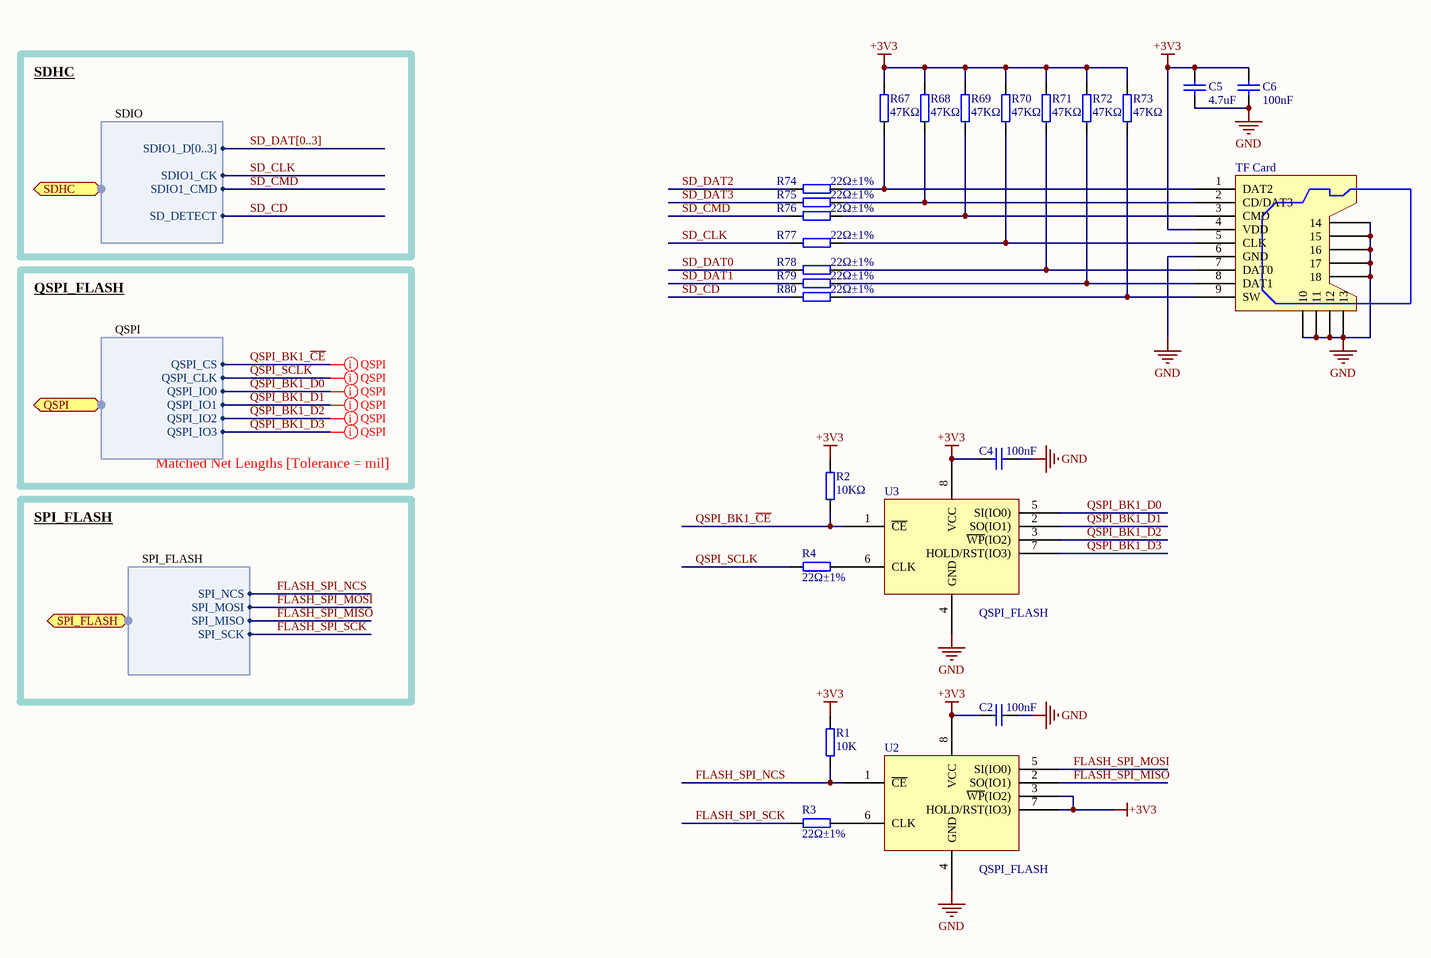
[diagram p3: ART-Pi_Memory.SchDoc]

### Parts
C2  100nF  [0402_C]
C4  100nF  [0402_C]
C5  4.7uF  [0402_C]
C6  100nF  [0402_C]
R1  10K  [0402_R]
R2  10KΩ  [0402_R]
R3  22Ω±1%  [0402_R]
R4  22Ω±1%  [0402_R]
R67  47KΩ  [0402_R]
R68  47KΩ  [0402_R]
R69  47KΩ  [0402_R]
R70  47KΩ  [0402_R]
R71  47KΩ  [0402_R]
R72  47KΩ  [0402_R]
R73  47KΩ  [0402_R]
R74  22Ω±1%  [0402_R]
R75  22Ω±1%  [0402_R]
R76  22Ω±1%  [0402_R]
R77  22Ω±1%  [0402_R]
R78  22Ω±1%  [0402_R]
R79  22Ω±1%  [0402_R]
R80  22Ω±1%  [0402_R]
TF_Card  microSD  [TF-SMD_TF-110]  (value not drawn)
U2  QSPI_FLASH  [SOIC_8]
U3  QSPI_FLASH  [SOIC_8]

### Ports
QSPI (harness Harness), SDHC (harness Harness), SPI_FLASH (harness Harness)

### Harnesses
Harness: SPI_NCS, SPI_MOSI, SPI_MISO, SPI_SCK
Harness: QSPI_CS, QSPI_CLK, QSPI_IO0, QSPI_IO1, QSPI_IO2, QSPI_IO3
Harness: SD_DETECT, SDIO1_D[0..3], SDIO1_CMD, SDIO1_CK

### Nets
+3V3: C2.2 C4.2 C5.2 C6.2 R1.1 R2.1 R67.1 R68.1 R69.1 R70.1 R71.1 R72.1 R73.1 TF_Card.4(VDD) U2.3(~{WP}(IO2)) U2.7(HOLD/RST(IO3)) U2.8(VCC) U3.8(VCC)
GND: C2.1 C4.1 C5.1 C6.1 TF_Card.6(GND) TF_Card.10 TF_Card.11 TF_Card.12 TF_Card.13 TF_Card.14 TF_Card.15 TF_Card.16 TF_Card.17 TF_Card.18 U2.4(GND) U3.4(GND)
FLASH_SPI_MISO: U2.2(SO(IO1)) ; port SPI_FLASH.SPI_MISO
FLASH_SPI_MOSI: U2.5(SI(IO0)) ; port SPI_FLASH.SPI_MOSI
FLASH_SPI_NCS: R1.2 U2.1(~{CE}) ; port SPI_FLASH.SPI_NCS
FLASH_SPI_SCK: R3.2 ; port SPI_FLASH.SPI_SCK
QSPI_BK1_~{CE}: R2.2 U3.1(~{CE}) ; port QSPI.QSPI_CS
QSPI_BK1_D0: U3.5(SI(IO0)) ; port QSPI.QSPI_IO0
QSPI_BK1_D1: U3.2(SO(IO1)) ; port QSPI.QSPI_IO1
QSPI_BK1_D2: U3.3(~{WP}(IO2)) ; port QSPI.QSPI_IO2
QSPI_BK1_D3: U3.7(HOLD/RST(IO3)) ; port QSPI.QSPI_IO3
QSPI_SCLK: R4.2 ; port QSPI.QSPI_CLK  [project net QSPI_CLK]
SD_CD: R80.2 ; port SDHC.SD_DETECT  [project net GPIO_CARD_DETECT]
SD_CLK: R77.2 ; port SDHC.SDIO1_CK
SD_CMD: R76.2 ; port SDHC.SDIO1_CMD
SD_DAT0: R78.2
SD_DAT1: R79.2
SD_DAT2: R74.2
SD_DAT3: R75.2
NetR3_1: R3.1 U2.6(CLK)
NetR4_1: R4.1 U3.6(CLK)
NetR67_2: R67.2 R74.1 TF_Card.1(DAT2)
NetR68_2: R68.2 R75.1 TF_Card.2(CD/DAT3)
NetR69_2: R69.2 R76.1 TF_Card.3(CMD)
NetR70_2: R70.2 R77.1 TF_Card.5(CLK)
NetR71_2: R71.2 R78.1 TF_Card.7(DAT0)
NetR72_2: R72.2 R79.1 TF_Card.8(DAT1)
NetR73_2: R73.2 R80.1 TF_Card.9(SW)

### Buses and harness runs
bus SD_DAT[0..3]

### Layout directives
rule Undefined: QSPI_BK1_D0, QSPI_BK1_D1, QSPI_BK1_D2, QSPI_BK1_D3, QSPI_BK1_~{CE}, QSPI_CLK

### Notes on the sheet
- SDHC
- SDIO
- QSPI_FLASH
- QSPI
- Matched Net Lengths [Tolerance = mil]
- SPI_FLASH
- Title
- Size:
- Date:
- A3
- Number:
- Time:
- Revision:
- Sheet
- of
- File:

### Library data of the parts
C2 C4-C6 = Cap: Capacitor; Published: 8-Jun-2000; LatestRevisionDate: 17-Jul-2002; LatestRevisionNote: Re-released for DXP Platform.; PackageReference: RAD-0.3; Publisher: Altium Limited; PackageDescription: Radial Cap, Thru-Hole; 2 Leads; 0.3 in Pin Spacing
R1-R4 R67-R80 = Res: Resister
U2 U3 = W25Q128

## Sheet ART-Pi_LCD&Camera.SchDoc: LCD_Connector
size A3; DocumentNumber: 9; Revision: V1.5; SheetNumber: 9; SheetTotal: 11; PageSetup: Record=PageOptions|CenterHorizontal=True|CenterVertical=True|PrintScale=1.01|XCorrection=1.00|YCorrection=1.00|PrintKind=0|BorderSize=5000000|LeftOffset=0|BottomOffset=0|Orientation=2|PaperLength=1000|PaperWidth=1000|Scale=100|PaperSource=7|PrintQuality=600|MediaType=1|DitherType=10|PrintScaleMode=1|PaperKind=A3(297x420mm)|PaperIndex=8
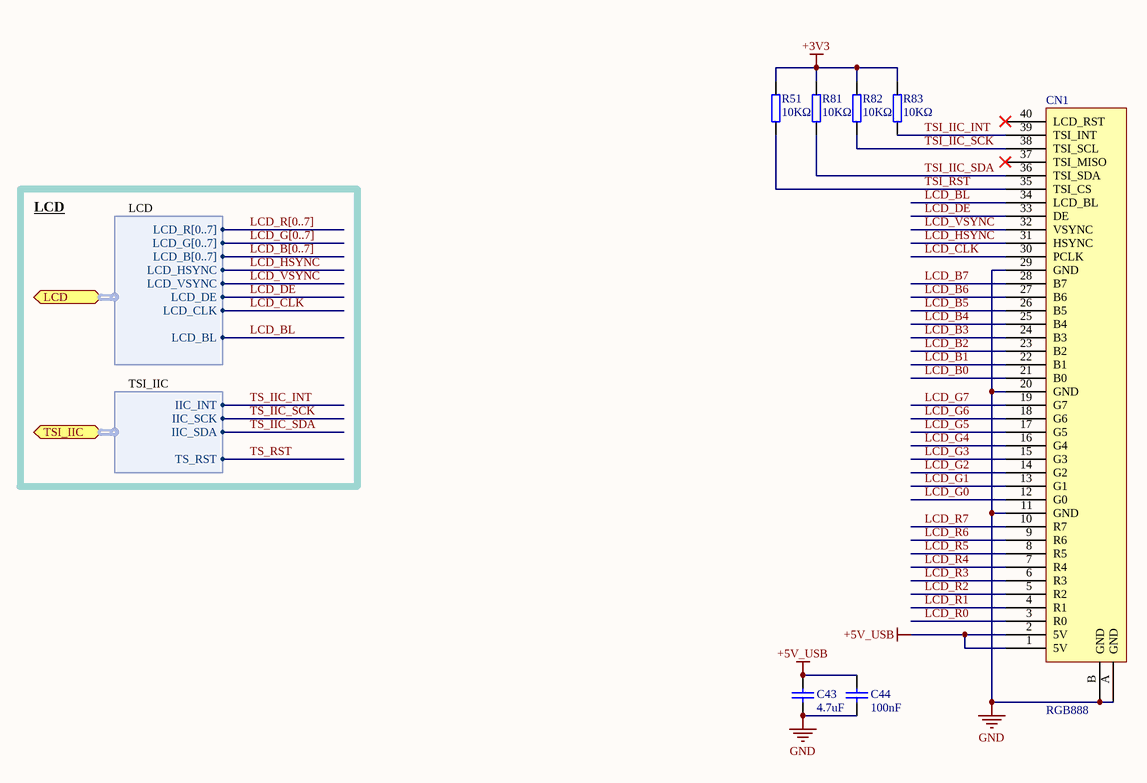
[diagram p4: ART-Pi_LCD&Camera.SchDoc]

### Parts
C43  4.7uF  [0402_C]
C44  100nF  [0402_C]
CN1  RGB888  [FPC-TOP40]
R51  10KΩ  [0402_R]
R81  10KΩ  [0402_R]
R82  10KΩ  [0402_R]
R83  10KΩ  [0402_R]

### Ports
LCD (harness Harness), TSI_IIC (harness Harness)

### Harnesses
Harness: IIC_INT, IIC_SCK, IIC_SDA, TS_RST
Harness: LCD_G[0..7], LCD_B[0..7], LCD_HSYNC, LCD_VSYNC, LCD_DE, LCD_CLK, LCD_BL, LCD_R[0..7]

### Nets
+3V3: R51.1 R81.1 R82.1 R83.1
+5V_USB: C43.2 C44.2 CN1.1(5V) CN1.2(5V)
GND: C43.1 C44.1 CN1.11(GND) CN1.20(GND) CN1.29(GND) CN1.A(GND) CN1.B(GND)
LCD_B0: CN1.21(B0)
LCD_B1: CN1.22(B1)
LCD_B2: CN1.23(B2)
LCD_B3: CN1.24(B3)
LCD_B4: CN1.25(B4)
LCD_B5: CN1.26(B5)
LCD_B6: CN1.27(B6)
LCD_B7: CN1.28(B7)
LCD_BL: CN1.34(LCD_BL) ; port LCD.LCD_BL  [project net GPIO_LCD_BL]
LCD_CLK: CN1.30(PCLK) ; port LCD.LCD_CLK
LCD_DE: CN1.33(DE) ; port LCD.LCD_DE
LCD_G0: CN1.12(G0)
LCD_G1: CN1.13(G1)
LCD_G2: CN1.14(G2)
LCD_G3: CN1.15(G3)
LCD_G4: CN1.16(G4)
LCD_G5: CN1.17(G5)
LCD_G6: CN1.18(G6)
LCD_G7: CN1.19(G7)
LCD_HSYNC: CN1.31(HSYNC) ; port LCD.LCD_HSYNC
LCD_R0: CN1.3(R0)
LCD_R1: CN1.4(R1)
LCD_R2: CN1.5(R2)
LCD_R3: CN1.6(R3)
LCD_R4: CN1.7(R4)
LCD_R5: CN1.8(R5)
LCD_R6: CN1.9(R6)
LCD_R7: CN1.10(R7)
LCD_VSYNC: CN1.32(VSYNC) ; port LCD.LCD_VSYNC
TSI_IIC_INT: CN1.39(TSI_INT) R83.2
TSI_IIC_SCK: CN1.38(TSI_SCL) R82.2
TSI_IIC_SDA: CN1.36(TSI_SDA) R81.2
TSI_RST: CN1.35(TSI_CS) R51.2

Not connected (* = marked no-connect by the designer): CN1 37(TSI_MISO)* 40(LCD_RST)*

### Buses and harness runs
bus LCD_B[0..7]
bus LCD_G[0..7]
bus LCD_R[0..7]

### Notes on the sheet
- LCD
- TSI_IIC
- Title
- Size:
- Date:
- A3
- Number:
- Time:
- Revision:
- Sheet
- of
- File:

### Library data of the parts
C43 C44 = Cap: Capacitor; Published: 8-Jun-2000; LatestRevisionDate: 17-Jul-2002; LatestRevisionNote: Re-released for DXP Platform.; PackageReference: RAD-0.3; Publisher: Altium Limited; PackageDescription: Radial Cap, Thru-Hole; 2 Leads; 0.3 in Pin Spacing
CN1 = FPC-40: FPC-40P-0.5mm
R51 R81-R83 = Res: Resister

## Sheet ART-Pi_H750_Peripherals.SchDoc: STM32H750XB_Peripherals
size A3; DocumentNumber: 6; Revision: V1.5; SheetNumber: 6; SheetTotal: 11; PageSetup: Record=PageOptions|CenterHorizontal=True|CenterVertical=True|PrintScale=1.01|XCorrection=1.00|YCorrection=1.00|PrintKind=0|BorderSize=5000000|LeftOffset=0|BottomOffset=0|Orientation=2|PaperLength=1000|PaperWidth=1000|Scale=100|PaperSource=7|PrintQuality=600|MediaType=1|DitherType=10|PrintScaleMode=1|PaperKind=A3(297x420mm)|PaperIndex=8
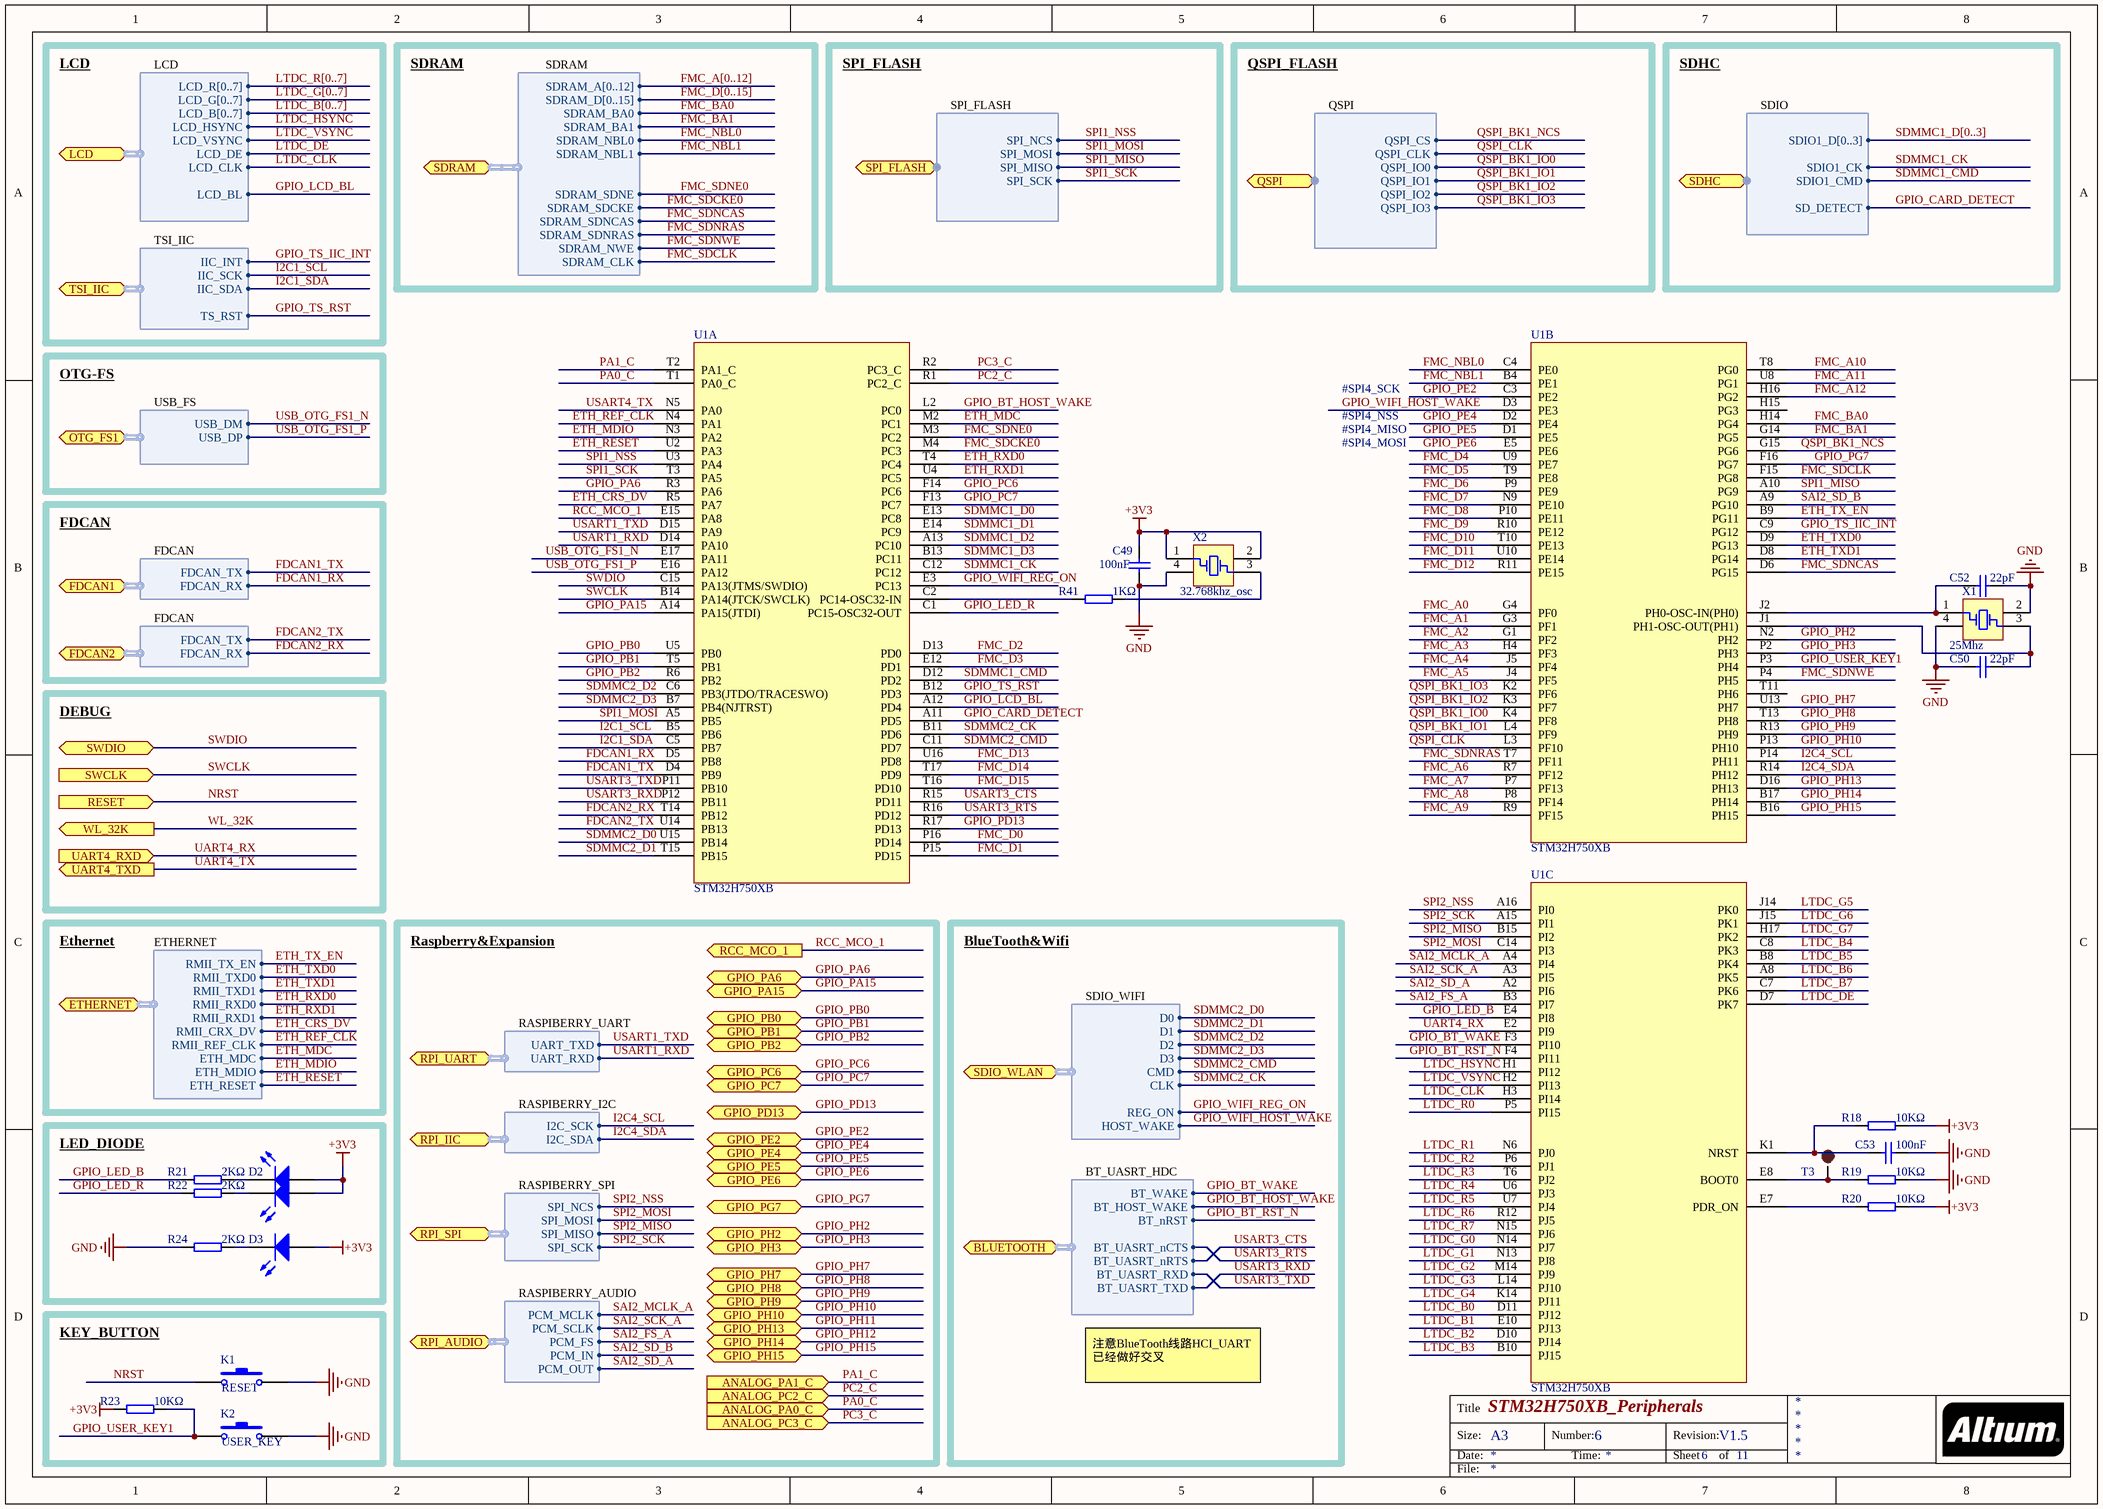
[diagram p5: ART-Pi_H750_Peripherals.SchDoc]

### Parts
C49  100nF  [0402_C]
C50  22pF  [0402_C]
C52  22pF  [0402_C]
C53  100nF  [0402_C]
D2  LED2  [LED2-0603]  (value not drawn)
D3  LED  [0603_LED]  (value not drawn)
K1  RESET  [SW-SMD]
K2  USER_KEY  [SW-SMD]
R18  10KΩ  [0402_R]
R19  10KΩ  [0402_R]
R20  10KΩ  [0402_R]
R21  2KΩ  [0402_R]
R22  2KΩ  [0402_R]
R23  10KΩ  [0402_R]
R24  2KΩ  [0402_R]
R41  1KΩ  [0402_R]
T3  TEST POINT  [Test_Point]  (value not drawn)
U1  STM32H750XB  [TFBGA240+25]  (parts A,B,C of 4)
X1  25Mhz  [SMD2520]
X2  32.768khz_osc  [SMD2520]

### Blocks framed on the sheet
LED_DIODE: D2 D3 R21 R22 R24
KEY_BUTTON: K1 K2 R23

### Ports
ANALOG_PA0_C (in), ANALOG_PA1_C (in), ANALOG_PC2_C (in), ANALOG_PC3_C (in), BLUETOOTH (harness Harness), ETHERNET (harness Harness), FDCAN1 (harness Harness), FDCAN2 (harness Harness), GPIO_PA6 (bidir), GPIO_PA15 (bidir), GPIO_PB0 (bidir), GPIO_PB1 (bidir), GPIO_PB2 (bidir), GPIO_PC6 (bidir), GPIO_PC7 (bidir), GPIO_PD13 (bidir), GPIO_PE2 (bidir), GPIO_PE4 (bidir), GPIO_PE5 (bidir), GPIO_PE6 (bidir), GPIO_PG7 (bidir), GPIO_PH2 (bidir), GPIO_PH3 (bidir), GPIO_PH7 (bidir), GPIO_PH8 (bidir), GPIO_PH9 (bidir), GPIO_PH10 (bidir), GPIO_PH13 (bidir), GPIO_PH14 (bidir), GPIO_PH15 (bidir), LCD (harness Harness), OTG_FS1 (harness Harness), QSPI (harness Harness), RCC_MCO_1 (out), RESET (in), RPI_AUDIO (harness Harness), RPI_IIC (harness Harness), RPI_SPI (harness Harness), RPI_UART (harness Harness), SDHC (harness Harness), SDIO_WLAN (harness Harness), SDRAM (harness Harness), SPI_FLASH (harness Harness), SWCLK (in), SWDIO (bidir), TSI_IIC (harness Harness), UART4_RXD (in), UART4_TXD (out), WL_32K (out)

### Harnesses
Harness: IIC_INT, IIC_SCK, IIC_SDA, TS_RST
Harness: LCD_G[0..7], LCD_B[0..7], LCD_HSYNC, LCD_VSYNC, LCD_DE, LCD_CLK, LCD_BL, LCD_R[0..7]
Harness: SDRAM_A[0..12], SDRAM_D[0..15], SDRAM_BA0, SDRAM_BA1, SDRAM_NBL0, SDRAM_NBL1, SDRAM_SDNE, SDRAM_SDCKE, SDRAM_SDNCAS, SDRAM_SDNRAS, SDRAM_NWE, SDRAM_CLK
Harness: SPI_NCS, SPI_MOSI, SPI_MISO, SPI_SCK
Harness: QSPI_CS, QSPI_CLK, QSPI_IO0, QSPI_IO1, QSPI_IO2, QSPI_IO3
Harness: SD_DETECT, SDIO1_D[0..3], SDIO1_CMD, SDIO1_CK
Harness: USB_DM, USB_DP
Harness: FDCAN_TX, FDCAN_RX
Harness: RMII_TX_EN, RMII_TXD0, RMII_TXD1, RMII_RXD0, RMII_RXD1, RMII_CRX_DV, RMII_REF_CLK, ETH_MDC, ETH_MDIO, ETH_RESET
Harness: UART_TXD, UART_RXD
Harness: I2C_SCK, I2C_SDA
Harness: PCM_MCLK, PCM_SCLK, PCM_FS, PCM_IN, PCM_OUT
Harness: D0, D1, D2, D3, CMD, CLK, REG_ON, HOST_WAKE
Harness: BT_WAKE, BT_HOST_WAKE, BT_nRST, BT_UASRT_nCTS, BT_UASRT_nRTS, BT_UASRT_RXD, BT_UASRT_TXD

### Nets
+3V3: C49.2 D2.1 D2.4 D3.1(A) R18.1 R20.1 R23.2 X2.1(OSC1) X2.2(OSC2)
GND: C49.1 C50.2 C52.1 C53.1 K1.2 K2.2 R19.1 R24.2 X1.2(OSC2) X1.4 X2.4
ETH_CRS_DV: U1.R5(PA7) ; port ETHERNET.RMII_CRX_DV
ETH_MDC: U1.M2(PC1) ; port ETHERNET.ETH_MDC
ETH_MDIO: U1.N3(PA2) ; port ETHERNET.ETH_MDIO
ETH_REF_CLK: U1.N4(PA1) ; port ETHERNET.RMII_REF_CLK
ETH_RESET: U1.U2(PA3) ; port ETHERNET.ETH_RESET
ETH_RXD0: U1.T4(PC4) ; port ETHERNET.RMII_RXD0
ETH_RXD1: U1.U4(PC5) ; port ETHERNET.RMII_RXD1
ETH_TX_EN: U1.B9(PG11) ; port ETHERNET.RMII_TX_EN
ETH_TXD0: U1.D9(PG13) ; port ETHERNET.RMII_TXD0
ETH_TXD1: U1.D8(PG14) ; port ETHERNET.RMII_TXD1
FDCAN1_RX: U1.D5(PB8) ; port FDCAN1.FDCAN_RX
FDCAN1_TX: U1.D4(PB9) ; port FDCAN1.FDCAN_TX
FDCAN2_RX: U1.T14(PB12) ; port FDCAN2.FDCAN_RX
FDCAN2_TX: U1.U14(PB13) ; port FDCAN2.FDCAN_TX
FMC_A0: U1.G4(PF0)
FMC_A1: U1.G3(PF1)
FMC_A2: U1.G1(PF2)
FMC_A3: U1.H4(PF3)
FMC_A4: U1.J5(PF4)
FMC_A5: U1.J4(PF5)
FMC_A6: U1.R7(PF12)
FMC_A7: U1.P7(PF13)
FMC_A8: U1.P8(PF14)
FMC_A9: U1.R9(PF15)
FMC_A10: U1.T8(PG0)
FMC_A11: U1.U8(PG1)
FMC_A12: U1.H16(PG2)
FMC_BA0: U1.H14(PG4) ; port SDRAM.SDRAM_BA0
FMC_BA1: U1.G14(PG5) ; port SDRAM.SDRAM_BA1
FMC_D0: U1.P16(PD14)
FMC_D1: U1.P15(PD15)
FMC_D2: U1.D13(PD0)
FMC_D3: U1.E12(PD1)
FMC_D4: U1.U9(PE7)
FMC_D5: U1.T9(PE8)
FMC_D6: U1.P9(PE9)
FMC_D7: U1.N9(PE10)
FMC_D8: U1.P10(PE11)
FMC_D9: U1.R10(PE12)
FMC_D10: U1.T10(PE13)
FMC_D11: U1.U10(PE14)
FMC_D12: U1.R11(PE15)
FMC_D13: U1.U16(PD8)
FMC_D14: U1.T17(PD9)
FMC_D15: U1.T16(PD10)
FMC_NBL0: U1.C4(PE0) ; port SDRAM.SDRAM_NBL0
FMC_NBL1: U1.B4(PE1) ; port SDRAM.SDRAM_NBL1
FMC_SDCKE0: U1.M4(PC3) ; port SDRAM.SDRAM_SDCKE
FMC_SDCLK: U1.F15(PG8) ; port SDRAM.SDRAM_CLK
FMC_SDNCAS: U1.D6(PG15) ; port SDRAM.SDRAM_SDNCAS
FMC_SDNE0: U1.M3(PC2) ; port SDRAM.SDRAM_SDNE
FMC_SDNRAS: U1.T7(PF11) ; port SDRAM.SDRAM_SDNRAS
FMC_SDNWE: U1.P4(PH5) ; port SDRAM.SDRAM_NWE
GPIO_BT_HOST_WAKE: U1.L2(PC0) ; port BLUETOOTH.BT_HOST_WAKE  [project net BT_HOST_WAKE]
GPIO_BT_RST_N: U1.F4(PI11) ; port BLUETOOTH.BT_nRST  [project net BT_RST_N]
GPIO_BT_WAKE: U1.F3(PI10) ; port BLUETOOTH.BT_WAKE  [project net BT_WAKE]
GPIO_CARD_DETECT: U1.A11(PD5) ; port SDHC.SD_DETECT
GPIO_LCD_BL: U1.A12(PD4) ; port LCD.LCD_BL
GPIO_LED_B: R21.2 U1.E4(PI8)
GPIO_LED_R: R22.2 U1.C1(PC15-OSC32-OUT)
GPIO_PA6: U1.R3(PA6) ; port GPIO_PA6
GPIO_PA15: U1.A14(PA15(JTDI)) ; port GPIO_PA15
GPIO_PB0: U1.U5(PB0) ; port GPIO_PB0
GPIO_PB1: U1.T5(PB1) ; port GPIO_PB1
GPIO_PB2: U1.R6(PB2) ; port GPIO_PB2
GPIO_PC6: U1.F14(PC6) ; port GPIO_PC6
GPIO_PC7: U1.F13(PC7) ; port GPIO_PC7
GPIO_PD13: U1.R17(PD13) ; port GPIO_PD13
GPIO_PE2: U1.C3(PE2) ; port GPIO_PE2
GPIO_PE4: U1.D2(PE4) ; port GPIO_PE4
GPIO_PE5: U1.D1(PE5) ; port GPIO_PE5
GPIO_PE6: U1.E5(PE6) ; port GPIO_PE6
GPIO_PG7: U1.F16(PG7) ; port GPIO_PG7
GPIO_PH2: U1.N2(PH2) ; port GPIO_PH2
GPIO_PH3: U1.P2(PH3) ; port GPIO_PH3
GPIO_PH7: U1.U13(PH7) ; port GPIO_PH7
GPIO_PH8: U1.T13(PH8) ; port GPIO_PH8
GPIO_PH9: U1.R13(PH9) ; port GPIO_PH9
GPIO_PH10: U1.P13(PH10) ; port GPIO_PH10
GPIO_PH11: U1.D16(PH13) ; port GPIO_PH13  [also labelled GPIO_PH13]
GPIO_PH12: U1.B17(PH14) ; port GPIO_PH14  [also labelled GPIO_PH14]
GPIO_PH15: U1.B16(PH15) ; port GPIO_PH15
GPIO_TS_IIC_INT: U1.C9(PG12) ; port TSI_IIC.IIC_INT
GPIO_TS_RST: U1.B12(PD3) ; port TSI_IIC.TS_RST
GPIO_USER_KEY1: K2.1 R23.1 U1.P3(PH4)
GPIO_WIFI_HOST_WAKE: U1.D3(PE3) ; port SDIO_WLAN.HOST_WAKE
GPIO_WIFI_REG_ON: U1.E3(PC13) ; port SDIO_WLAN.REG_ON
I2C1_SCL: U1.B5(PB6) ; port TSI_IIC.IIC_SCK
I2C1_SDA: U1.C5(PB7) ; port TSI_IIC.IIC_SDA
I2C4_SCL: U1.P14(PH11) ; port RPI_IIC.I2C_SCK
I2C4_SDA: U1.R14(PH12) ; port RPI_IIC.I2C_SDA
LTDC_B0: U1.D11(PJ12)  [project net LCD_B0]
LTDC_B1: U1.E10(PJ13)  [project net LCD_B1]
LTDC_B2: U1.D10(PJ14)  [project net LCD_B2]
LTDC_B3: U1.B10(PJ15)  [project net LCD_B3]
LTDC_B4: U1.C8(PK3)  [project net LCD_B4]
LTDC_B5: U1.B8(PK4)  [project net LCD_B5]
LTDC_B6: U1.A8(PK5)  [project net LCD_B6]
LTDC_B7: U1.C7(PK6)  [project net LCD_B7]
LTDC_CLK: U1.H3(PI14) ; port LCD.LCD_CLK  [project net LCD_CLK]
LTDC_DE: U1.D7(PK7) ; port LCD.LCD_DE  [project net LCD_DE]
LTDC_G0: U1.N14(PJ7)  [project net LCD_G0]
LTDC_G1: U1.N13(PJ8)  [project net LCD_G1]
LTDC_G2: U1.M14(PJ9)  [project net LCD_G2]
LTDC_G3: U1.L14(PJ10)  [project net LCD_G3]
LTDC_G4: U1.K14(PJ11)  [project net LCD_G4]
LTDC_G5: U1.J14(PK0)  [project net LCD_G5]
LTDC_G6: U1.J15(PK1)  [project net LCD_G6]
LTDC_G7: U1.H17(PK2)  [project net LCD_G7]
LTDC_HSYNC: U1.H1(PI12) ; port LCD.LCD_HSYNC  [project net LCD_HSYNC]
LTDC_R0: U1.P5(PI15)  [project net LCD_R0]
LTDC_R1: U1.N6(PJ0)  [project net LCD_R1]
LTDC_R2: U1.P6(PJ1)  [project net LCD_R2]
LTDC_R3: U1.T6(PJ2)  [project net LCD_R3]
LTDC_R4: U1.U6(PJ3)  [project net LCD_R4]
LTDC_R5: U1.U7(PJ4)  [project net LCD_R5]
LTDC_R6: U1.R12(PJ5)  [project net LCD_R6]
LTDC_R7: U1.N15(PJ6)  [project net LCD_R7]
LTDC_VSYNC: U1.H2(PI13) ; port LCD.LCD_VSYNC  [project net LCD_VSYNC]
NRST: K1.1 ; port RESET
PA0_C: U1.T1(PA0_C) ; port ANALOG_PA0_C
PA1_C: U1.T2(PA1_C) ; port ANALOG_PA1_C
PC2_C: U1.R1(PC2_C) ; port ANALOG_PC2_C
PC3_C: U1.R2(PC3_C) ; port ANALOG_PC3_C
QSPI_BK1_IO0: U1.K4(PF8) ; port QSPI.QSPI_IO0  [project net QSPI_BK1_D0]
QSPI_BK1_IO1: U1.L4(PF9) ; port QSPI.QSPI_IO1  [project net QSPI_BK1_D1]
QSPI_BK1_IO2: U1.K3(PF7) ; port QSPI.QSPI_IO2  [project net QSPI_BK1_D2]
QSPI_BK1_IO3: U1.K2(PF6) ; port QSPI.QSPI_IO3  [project net QSPI_BK1_D3]
QSPI_BK1_NCS: U1.G15(PG6) ; port QSPI.QSPI_CS  [project net QSPI_BK1_~{CE}]
QSPI_CLK: U1.L3(PF10) ; port QSPI.QSPI_CLK
RCC_MCO_1: U1.E15(PA8) ; port RCC_MCO_1
SAI2_FS_A: U1.B3(PI7) ; port RPI_AUDIO.PCM_FS  [project net PCM_FS]
SAI2_MCLK_A: U1.A4(PI4) ; port RPI_AUDIO.PCM_MCLK  [project net PCM_MCLK]
SAI2_SCK_A: U1.A3(PI5) ; port RPI_AUDIO.PCM_SCLK  [project net PCM_SCLK]
SAI2_SD_A: U1.A2(PI6) ; port RPI_AUDIO.PCM_OUT  [project net PCM_OUT]
SAI2_SD_B: U1.A9(PG10) ; port RPI_AUDIO.PCM_IN  [project net PCM_IN]
SDMMC1_CK: U1.C12(PC12) ; port SDHC.SDIO1_CK  [project net SD_CLK]
SDMMC1_CMD: U1.D12(PD2) ; port SDHC.SDIO1_CMD  [project net SD_CMD]
SDMMC1_D0: U1.E13(PC8)  [project net SD_DAT0]
SDMMC1_D1: U1.E14(PC9)  [project net SD_DAT1]
SDMMC1_D2: U1.A13(PC10)  [project net SD_DAT2]
SDMMC1_D3: U1.B13(PC11)  [project net SD_DAT3]
SDMMC2_CK: U1.B11(PD6) ; port SDIO_WLAN.CLK
SDMMC2_CMD: U1.C11(PD7) ; port SDIO_WLAN.CMD
SDMMC2_D0: U1.U15(PB14) ; port SDIO_WLAN.D0
SDMMC2_D1: U1.T15(PB15) ; port SDIO_WLAN.D1
SDMMC2_D2: U1.C6(PB3(JTDO/TRACESWO)) ; port SDIO_WLAN.D2
SDMMC2_D3: U1.B7(PB4(NJTRST)) ; port SDIO_WLAN.D3
SPI1_MISO: U1.A10(PG9) ; port SPI_FLASH.SPI_MISO  [project net FLASH_SPI_MISO]
SPI1_MOSI: U1.A5(PB5) ; port SPI_FLASH.SPI_MOSI  [project net FLASH_SPI_MOSI]
SPI1_NSS: U1.U3(PA4) ; port SPI_FLASH.SPI_NCS  [project net FLASH_SPI_NCS]
SPI1_SCK: U1.T3(PA5) ; port SPI_FLASH.SPI_SCK  [project net FLASH_SPI_SCK]
SPI2_MISO: U1.B15(PI2) ; port RPI_SPI.SPI_MISO  [project net RPI_SPI_MISO]
SPI2_MOSI: U1.C14(PI3) ; port RPI_SPI.SPI_MOSI  [project net RPI_SPI_MOSI]
SPI2_NSS: U1.A16(PI0) ; port RPI_SPI.SPI_NCS  [project net RPI_SPI_NSS]
SPI2_SCK: U1.A15(PI1) ; port RPI_SPI.SPI_SCK  [project net RPI_SPI_SCK]
SWCLK: U1.B14(PA14(JTCK/SWCLK)) ; port SWCLK
SWDIO: U1.C15(PA13(JTMS/SWDIO)) ; port SWDIO
UART4_RX: U1.E2(PI9) ; port UART4_RXD
UART4_TX: port UART4_TXD
USART1_RXD: U1.D14(PA10) ; port RPI_UART.UART_RXD  [project net RPI_UART_RXD]
USART1_TXD: U1.D15(PA9) ; port RPI_UART.UART_TXD  [project net RPI_UART_TXD]
USART3_CTS: U1.R15(PD11) ; port BLUETOOTH.BT_UASRT_nRTS  [project net BT_UART_CTS_N]
USART3_RTS: U1.R16(PD12) ; port BLUETOOTH.BT_UASRT_nCTS  [project net BT_UART_RTS_N]
USART3_RXD: U1.P12(PB11) ; port BLUETOOTH.BT_UASRT_TXD  [project net BT_UART_RXD]
USART3_TXD: U1.P11(PB10) ; port BLUETOOTH.BT_UASRT_RXD  [project net BT_UART_TXD]
USART4_TX: U1.N5(PA0)
USB_OTG_FS1_N: U1.E17(PA11) ; port OTG_FS1.USB_DM
USB_OTG_FS1_P: U1.E16(PA12) ; port OTG_FS1.USB_DP
NetC50_1: C50.1 U1.J1(PH1-OSC-OUT(PH1)) X1.3
NetC52_2: C52.2 U1.J2(PH0-OSC-IN(PH0)) X1.1(OSC1)
NetC53_2: C53.2 R18.2 U1.K1(NRST)
NetD2_2: D2.2 R22.1
NetD2_3: D2.3 R21.1
NetD3_2: D3.2(K) R24.1
NetR19_2: R19.2 T3.1 U1.E8(BOOT0)
NetR20_2: R20.2 U1.E7(PDR_ON)
NetR41_1: R41.1 X2.3
NetR41_2: R41.2 U1.C2(PC14-OSC32-IN)

Not connected (* = marked no-connect by the designer): U1 H15(PG3) T11(PH6)

### Buses and harness runs
bus FMC_A[0..12]
bus FMC_D[0..15]
bus LTDC_B[0..7]
bus LTDC_G[0..7]
bus LTDC_R[0..7]
bus SDMMC1_D[0..3]

### Notes on the sheet
- LCD
- SDRAM
- SPI_FLASH
- QSPI_FLASH
- QSPI
- SDHC
- SDIO
- TSI_IIC
- OTG-FS
- USB_FS
- #SPI4_SCK
- #SPI4_NSS
- #SPI4_MISO
- #SPI4_MOSI
- FDCAN
- DEBUG
- Ethernet
- ETHERNET
- Raspberry&Expansion
- BlueTooth&Wifi
- RASPIBERRY_UART
- SDIO_WIFI
- RASPIBERRY_I2C
- RASPIBERRY_SPI
- BT_UASRT_HDC
- RASPIBERRY_AUDIO
- 注意BlueTooth线路HCI_UART已经做好交叉
- Title
- Size:
- Date:
- A3
- Number:
- Time:
- Revision:
- Sheet
- of
- File:

### Library data of the parts
C49 C50 C52 C53 = Cap: Capacitor; Published: 8-Jun-2000; LatestRevisionDate: 17-Jul-2002; LatestRevisionNote: Re-released for DXP Platform.; PackageReference: RAD-0.3; Publisher: Altium Limited; PackageDescription: Radial Cap, Thru-Hole; 2 Leads; 0.3 in Pin Spacing
D2 = LED2: Typical RED, GREEN, YELLOW, AMBER GaAs LED; Published: 8-Jun-2000; LatestRevisionDate: 17-Jul-2002; LatestRevisionNote: Re-released for DXP Platform.; PackageVersion: Feb-2002; PackageReference: 3.2X1.6X1.1; Publisher: Altium Limited; PackageDescription: SM LED; 2 Flat Leads
D3 = LED: Typical RED, GREEN, YELLOW, AMBER GaAs LED; Published: 8-Jun-2000; LatestRevisionDate: 17-Jul-2002; LatestRevisionNote: Re-released for DXP Platform.; PackageVersion: Feb-2002; PackageReference: 3.2X1.6X1.1; Publisher: Altium Limited; PackageDescription: SM LED; 2 Flat Leads
K1 K2 = SW_PB: Switch; Published: 24-Mar-1999; LatestRevisionDate: 17-Jul-2002; LatestRevisionNote: Re-released for DXP Platform.; PackageReference: SPST-2; Publisher: Altium Limited; PackageDescription: Switch; 2 Leads
R18-R24 R41 = Res: Resister
T3 = TEST-POINT: 测试点
X1 X2 = XTAL_3225: Crystal Oscillator; Published: 8-Jun-2000; LatestRevisionDate: 17-Jul-2002; LatestRevisionNote: Re-released for DXP Platform.; PackageReference: R38; Publisher: Altium Limited; PackageDescription: Crystal, Thru-Hole; 2 Leads; Body 3.1 x 8.2 mm (Dia.xH)

## Sheet ART-Pi_F103_AP6212.SchDoc: ST-LINK_V2.1&AP6212A
size A3; DocumentNumber: 11; Revision: V1.5; SheetNumber: 11; SheetTotal: 11; PageSetup: Record=PageOptions|CenterHorizontal=True|CenterVertical=True|PrintScale=1.01|XCorrection=1.00|YCorrection=1.00|PrintKind=0|BorderSize=5000000|LeftOffset=0|BottomOffset=0|Orientation=2|PaperLength=1000|PaperWidth=1000|Scale=100|PaperSource=7|PrintQuality=600|MediaType=1|DitherType=10|PrintScaleMode=1|PaperKind=A3(297x420mm)|PaperIndex=8
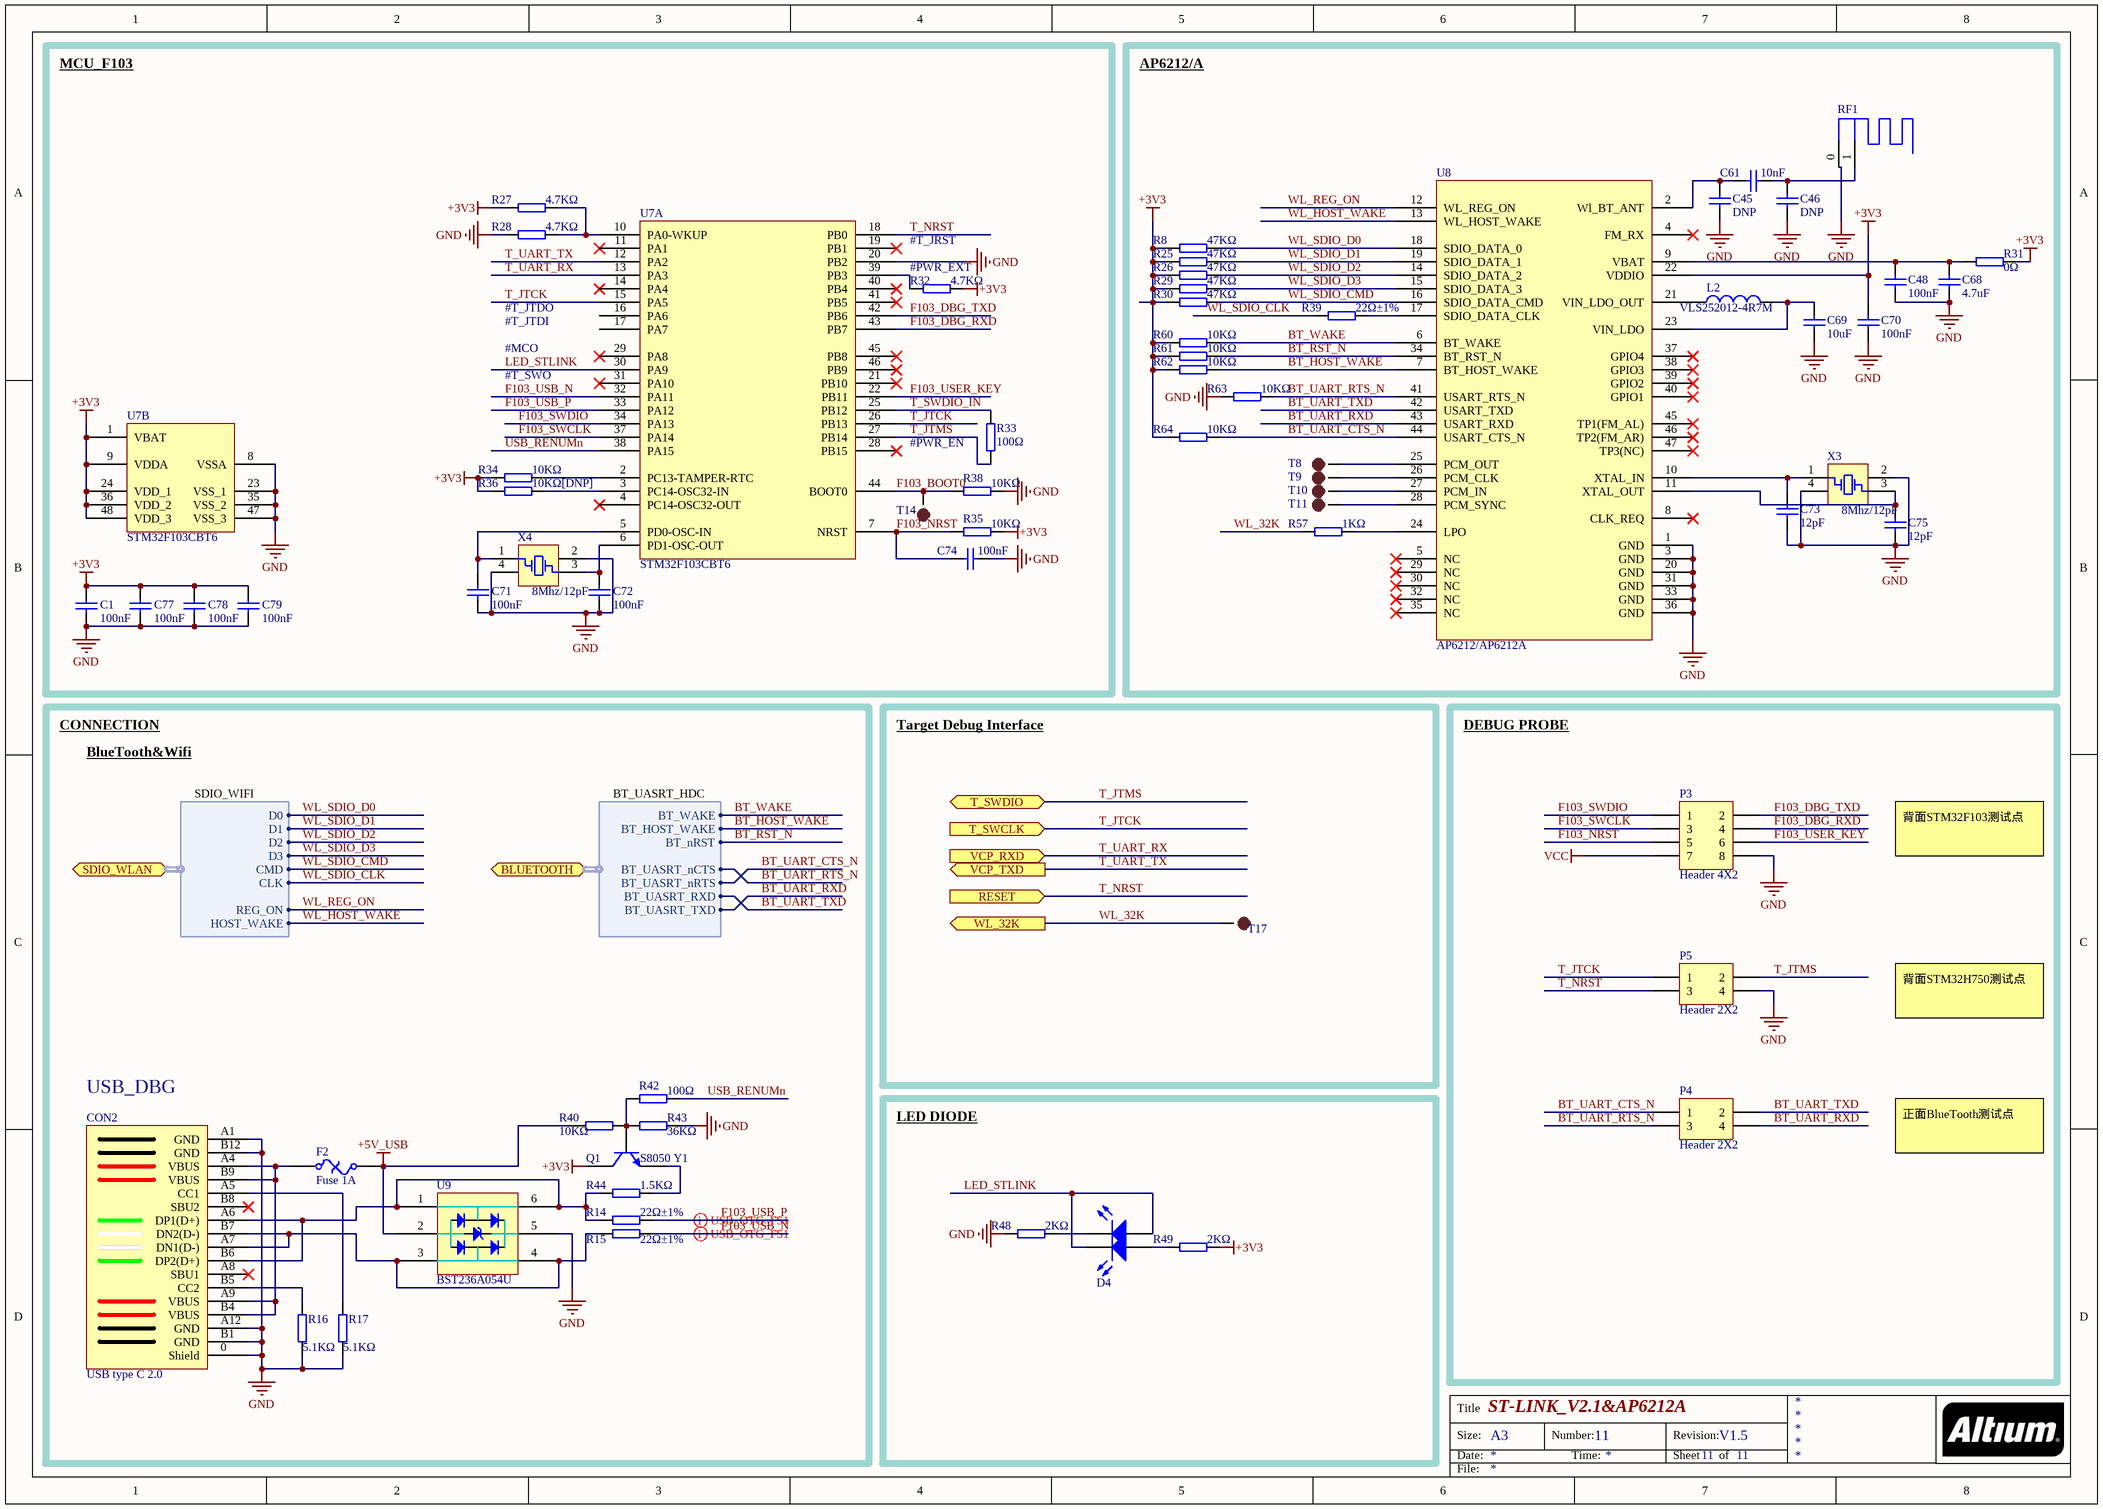
[diagram p6: ART-Pi_F103_AP6212.SchDoc]

### Parts
C1  100nF  [0402_C]
C45  DNP  [0402_C]
C46  DNP  [0402_C]
C48  100nF  [0402_C]
C61  10nF  [0402_C]
C68  4.7uF  [0402_C]
C69  10uF  [0402_C]
C70  100nF  [0402_C]
C71  100nF  [0402_C]
C72  100nF  [0402_C]
C73  12pF  [0402_C]
C74  100nF  [0402_C]
C75  12pF  [0402_C]
C77  100nF  [0402_C]
C78  100nF  [0402_C]
C79  100nF  [0402_C]
CON2  USB type C 2.0  [USB_C]
D4  LED2  [LED2-0603]  (value not drawn)
F2  Fuse 1A  [0805_R]
L2  VLS252012-4R7M  [FNR252012S]
P3  Header 4X2  [Test_Point_8]
P4  Header 2X2  [Test_Point_4]
P5  Header 2X2  [Test_Point_4]
Q1  S8050 Y1  [SOT23_P]
R8  47KΩ  [0402_R]
R14  22Ω±1%  [0402_R]
R15  22Ω±1%  [0402_R]
R16  5.1KΩ  [0402_R]
R17  5.1KΩ  [0402_R]
R25  47KΩ  [0402_R]
R26  47KΩ  [0402_R]
R27  4.7KΩ  [0402_R]
R28  4.7KΩ  [0402_R]
R29  47KΩ  [0402_R]
R30  47KΩ  [0402_R]
R31  0Ω  [0402_R]
R32  4.7KΩ  [0402_R]
R33  100Ω  [0402_R]
R34  10KΩ  [0402_R]
R35  10KΩ  [0402_R]
R36  10KΩ[DNP]  [0402_R]
R38  10KΩ  [0402_R]
R39  22Ω±1%  [0402_R]
R40  10KΩ  [0402_R]
R42  100Ω  [0402_R]
R43  36KΩ  [0402_R]
R44  1.5KΩ  [0402_R]
R48  2KΩ  [0402_R]
R49  2KΩ  [0402_R]
R57  1KΩ  [0402_R]
R60  10KΩ  [0402_R]
R61  10KΩ  [0402_R]
R62  10KΩ  [0402_R]
R63  10KΩ  [0402_R]
R64  10KΩ  [0402_R]
RF1  ANT  [RF]  (value not drawn)
T8  TEST POINT  [Test_Point]  (value not drawn)
T9  TEST POINT  [Test_Point]  (value not drawn)
T10  TEST POINT  [Test_Point]  (value not drawn)
T11  TEST POINT  [Test_Point]  (value not drawn)
T14  TEST POINT  [Test_Point]  (value not drawn)
T17  TEST POINT  [Test_Point]  (value not drawn)
U7  STM32F103CBT6  [LQFP48_N]  (parts A,B of 2)
U8  AP6212/AP6212A  [AP6212A]
U9  BST236A054U  [SOT23_6]
X3  8Mhz/12pF  [SMD2520]
X4  8Mhz/12pF  [XT-3225-4P]

### Blocks framed on the sheet
MCU_F103: C1 C71 C72 C74 C77-C79 R27 R28 R32-R36 R38 T14 U7 X4
AP6212/A: C45 C46 C48 C61 C68-C70 C73 C75 L2 R8 R25 R26 R29-R31 R39 R57 R60-R64 RF1 T8-T11 U8 X3
USB_DBG: CON2 F2 Q1 R14-R17 R40 R42-R44 U9
Target Debug Interface: T17
DEBUG PROBE: P3-P5
LED DIODE: D4 R48 R49

### Ports
BLUETOOTH (harness Harness), RESET (in), SDIO_WLAN (harness Harness), T_SWCLK (in), T_SWDIO (bidir), VCP_RXD (in), VCP_TXD (out), WL_32K (out)

### Harnesses
Harness: D0, D1, D2, D3, CMD, CLK, REG_ON, HOST_WAKE
Harness: BT_WAKE, BT_HOST_WAKE, BT_nRST, BT_UASRT_nCTS, BT_UASRT_nRTS, BT_UASRT_RXD, BT_UASRT_TXD

### Nets
+3V3: C1.2 C70.1 C77.2 C78.2 C79.2 Q1.1(C) R8.1 R25.1 R26.1 R27.2 R29.1 R30.1 R31.2 R32.1 R34.2 R35.2 R36.2 R49.2 R60.1 R61.1 R62.1 R64.1 U7.1(VBAT) U7.9(VDDA) U7.24(VDD_1) U7.36(VDD_2) U7.48(VDD_3) U8.22(VDDIO)
+5V_USB: F2.2 R40.1 U9.2
GND: C1.1 C45.2 C46.2 C48.2 C68.2 C69.2 C70.2 C71.1 C72.1 C73.2 C74.1 C75.2 C77.1 C78.1 C79.1 CON2.0(Shield) CON2.A1(GND) CON2.A12(GND) CON2.B1(GND) CON2.B12(GND) P3.8 P5.4 R16.2 R17.2 R28.2 R38.2 R43.2 R48.1 R63.1 RF1.0 U7.8(VSSA) U7.20(PB2) U7.23(VSS_1) U7.35(VSS_2) U7.47(VSS_3) U8.1(GND) U8.3(GND) U8.20(GND) U8.31(GND) U8.33(GND) U8.36(GND) U9.5 X3.2(OSC2) X3.4 X4.2(OSC2) X4.4
VCC: P3.7
BT_HOST_WAKE: R62.2 U8.7(BT_HOST_WAKE) ; port BLUETOOTH.BT_HOST_WAKE
BT_RST_N: R61.2 U8.34(BT_RST_N) ; port BLUETOOTH.BT_nRST
BT_UART_CTS_N: P4.1 R64.2 U8.44(USART_CTS_N) ; port BLUETOOTH.BT_UASRT_nRTS
BT_UART_RTS_N: P4.3 R63.2 U8.41(USART_RTS_N) ; port BLUETOOTH.BT_UASRT_nCTS
BT_UART_RXD: P4.4 U8.43(USART_RXD) ; port BLUETOOTH.BT_UASRT_TXD
BT_UART_TXD: P4.2 U8.42(USART_TXD) ; port BLUETOOTH.BT_UASRT_RXD
BT_WAKE: R60.2 U8.6(BT_WAKE) ; port BLUETOOTH.BT_WAKE
F103_BOOT0: R38.1 T14.1 U7.44(BOOT0)
F103_DBG_RXD: P3.4 U7.43(PB7)
F103_DBG_TXD: P3.2 U7.42(PB6)
F103_NRST: C74.2 P3.5 R35.1 U7.7(NRST)
F103_SWCLK: P3.3 U7.37(PA14)
F103_SWDIO: P3.1 U7.34(PA13)
F103_USB_N: R15.2 U7.32(PA11)
F103_USB_P: R14.2 U7.33(PA12)
F103_USER_KEY: P3.6 U7.22(PB11)
LED_STLINK: D4.2 D4.4 U7.30(PA9)
T_JTCK: P5.1 U7.15(PA5) U7.26(PB13) ; port T_SWCLK
T_JTMS: P5.2 R33.2 U7.27(PB14) ; port T_SWDIO
T_NRST: P5.3 U7.18(PB0) ; port RESET  [project net NRST]
T_SWDIO_IN: R33.1 U7.25(PB12)
T_UART_RX: U7.13(PA3) ; port VCP_RXD
T_UART_TX: U7.12(PA2) ; port VCP_TXD
USB_RENUMn: R42.2 U7.38(PA15)
WL_32K: R57.1 T17.1 ; port WL_32K
WL_HOST_WAKE: U8.13(WL_HOST_WAKE) ; port SDIO_WLAN.HOST_WAKE  [project net GPIO_WIFI_HOST_WAKE]
WL_REG_ON: U8.12(WL_REG_ON) ; port SDIO_WLAN.REG_ON  [project net GPIO_WIFI_REG_ON]
WL_SDIO_CLK: R39.1 ; port SDIO_WLAN.CLK  [project net SDMMC2_CK]
WL_SDIO_CMD: R30.2 U8.16(SDIO_DATA_CMD) ; port SDIO_WLAN.CMD  [project net SDMMC2_CMD]
WL_SDIO_D0: R8.2 U8.18(SDIO_DATA_0) ; port SDIO_WLAN.D0  [project net SDMMC2_D0]
WL_SDIO_D1: R25.2 U8.19(SDIO_DATA_1) ; port SDIO_WLAN.D1  [project net SDMMC2_D1]
WL_SDIO_D2: R26.2 U8.14(SDIO_DATA_2) ; port SDIO_WLAN.D2  [project net SDMMC2_D2]
WL_SDIO_D3: R29.2 U8.15(SDIO_DATA_3) ; port SDIO_WLAN.D3  [project net SDMMC2_D3]
NetC45_1: C45.1 C61.2 U8.2(Wl_BT_ANT)
NetC46_1: C46.1 C61.1 RF1.1
NetC48_1: C48.1 C68.1 R31.1 U8.9(VBAT)
NetC69_1: C69.1 L2.2 U8.23(VIN_LDO)
NetC71_2: C71.2 U7.5(PD0-OSC-IN) X4.1(OSC1)
NetC72_2: C72.2 U7.6(PD1-OSC-OUT) X4.3
NetC73_1: C73.1 U8.10(XTAL_IN) X3.1(OSC1)
NetC75_1: C75.1 U8.11(XTAL_OUT) X3.3
NetCON2_A4: CON2.A4(VBUS) CON2.A9(VBUS) CON2.B4(VBUS) CON2.B9(VBUS) F2.1
NetCON2_A5: CON2.A5(CC1) R17.1
NetCON2_A6: CON2.A6(DP1(D+)) CON2.B6(DP2(D+)) R14.1 R44.1 U9.1 U9.6
NetCON2_A7: CON2.A7(DN1(D-)) CON2.B7(DN2(D-)) R15.1 U9.3 U9.4
NetCON2_B5: CON2.B5(CC2) R16.1
NetD4_1: D4.1 R49.1
NetD4_3: D4.3 R48.2
NetL2_1: L2.1 U8.21(VIN_LDO_OUT)
NetQ1_2: Q1.2(E) R44.2
NetQ1_3: Q1.3(B) R40.2 R42.1 R43.1
NetR27_1: R27.1 R28.1 U7.10(PA0-WKUP)
NetR32_2: R32.2 U7.39(PB3)
NetR34_1: R34.1 U7.2(PC13-TAMPER-RTC)
NetR36_1: R36.1 U7.3(PC14-OSC32-IN)
NetR39_2: R39.2 U8.17(SDIO_DATA_CLK)
NetR57_2: R57.2 U8.24(LPO)
NetT8_1: T8.1 U8.25(PCM_OUT)
NetT9_1: T9.1 U8.26(PCM_CLK)
NetT10_1: T10.1 U8.27(PCM_IN)
NetT11_1: T11.1 U8.28(PCM_SYNC)

Not connected (* = marked no-connect by the designer): CON2 A8(SBU1)* B8(SBU2)*; U7 4(PC14-OSC32-OUT)* 11(PA1)* 14(PA4)* 16(PA6) 17(PA7) 19(PB1)* 21(PB10)* 28(PB15)* 29(PA8)* 31(PA10)* 40(PB4)* 41(PB5)* 45(PB8)* 46(PB9)*; U8 4(FM_RX)* 5(NC)* 8(CLK_REQ)* 29(NC)* 30(NC)* 32(NC)* 35(NC)* 37(GPIO4)* 38(GPIO3)* 39(GPIO2)* 40(GPIO1)* 45(TP1(FM_AL))* 46(TP2(FM_AR))* 47(TP3(NC))*

### Layout directives
differential pair: F103_USB_N, F103_USB_P

### Notes on the sheet
- #T_JRST
- #T_JTDO
- (near R32) #PWR_EXT
- #T_JTDI
- #MCO
- #T_SWO
- #PWR_EN
- CONNECTION
- BlueTooth&Wifi
- SDIO_WIFI
- BT_UASRT_HDC
- 背面STM32F103测试点
- 背面STM32H750测试点
- 正面BlueTooth测试点
- Title
- Size:
- Date:
- A3
- Number:
- Time:
- Revision:
- Sheet
- of
- File:

### Library data of the parts
C1 C45 C46 C48 C61 C68-C75 C77-C79 = Cap: Capacitor; Published: 8-Jun-2000; LatestRevisionDate: 17-Jul-2002; LatestRevisionNote: Re-released for DXP Platform.; PackageReference: RAD-0.3; Publisher: Altium Limited; PackageDescription: Radial Cap, Thru-Hole; 2 Leads; 0.3 in Pin Spacing
CON2 = USB type C
D4 = LED2: as D2 on sheet ART-Pi_H750_Peripherals; Published: 8-Jun-2000; LatestRevisionDate: 17-Jul-2002; LatestRevisionNote: Re-released for DXP Platform.; PackageVersion: Feb-2002; PackageReference: 3.2X1.6X1.1; Publisher: Altium Limited; PackageDescription: SM LED; 2 Flat Leads
F2 = Fuse Thermal: Thermal Fuse; Published: 24-Mar-1999; LatestRevisionDate: 17-Jul-2002; LatestRevisionNote: Re-released for DXP Platform.; PackageReference: PIN-W2/E2.8; Publisher: Altium Limited; PackageDescription: Thru-Hole; 2 Leads
L2 = Inductor: Code_IEC: 1005; Value: 10mH; Published: 8-Jun-2000; LatestRevisionDate: 29-May-2009; LatestRevisionNote: IPC-7351 Footprint Added.; PackageReference: 0402-A; Publisher: Altium Limited; PackageDescription: Chip Inductor; Code_JEITA: 0402
P3 = Header 4X2: Header, 4-Pin, Dual row; LatestRevisionDate: 17-Jul-2002; LatestRevisionNote: Re-released for DXP Platform.; Publisher: Altium Limited
P4 P5 = Header 2X2: Header, 2-Pin, Dual row; LatestRevisionDate: 17-Jul-2002; LatestRevisionNote: Re-released for DXP Platform.; Publisher: Altium Limited
Q1 = NPN: NPN Bipolar Transistor; Published: 8-Jun-2000; LatestRevisionDate: 17-Jul-2002; LatestRevisionNote: Re-released for DXP Platform.; PackageReference: TO-226-AA; Publisher: Altium Limited; PackageDescription: TO, Flat Index; 3 In-Line, Axial Leads; Body Dia. 4.8mm; Leads 0.55 x 0.51 mm (max); Code_JEDEC: TO-226-AA
R8 R14-R17 R25-R36 R38-R40 R42-R44 R48 R49 R57 R60-R64 = Res: Resister
RF1 = PCB-ANT-2.4G-S
T8-T11 T14 T17 = TEST-POINT: 测试点
X3 X4 = XTAL_3225: Crystal Oscillator; Published: 8-Jun-2000; LatestRevisionDate: 17-Jul-2002; LatestRevisionNote: Re-released for DXP Platform.; PackageReference: R38; Publisher: Altium Limited; PackageDescription: Crystal, Thru-Hole; 2 Leads; Body 3.1 x 8.2 mm (Dia.xH)

## Sheet ART-Pi_Content.SchDoc: Content
size A3; DocumentNumber: 1; Revision: V1.5; SheetNumber: 1; SheetTotal: 11; PageSetup: Record=PageOptions|CenterHorizontal=True|CenterVertical=True|PrintScale=1.01|XCorrection=1.00|YCorrection=1.00|PrintKind=0|BorderSize=5000000|LeftOffset=0|BottomOffset=0|Orientation=2|PaperLength=1000|PaperWidth=1000|Scale=100|PaperSource=7|PrintQuality=600|MediaType=1|DitherType=10|PrintScaleMode=1|PaperKind=A3(297x420mm)|PaperIndex=8
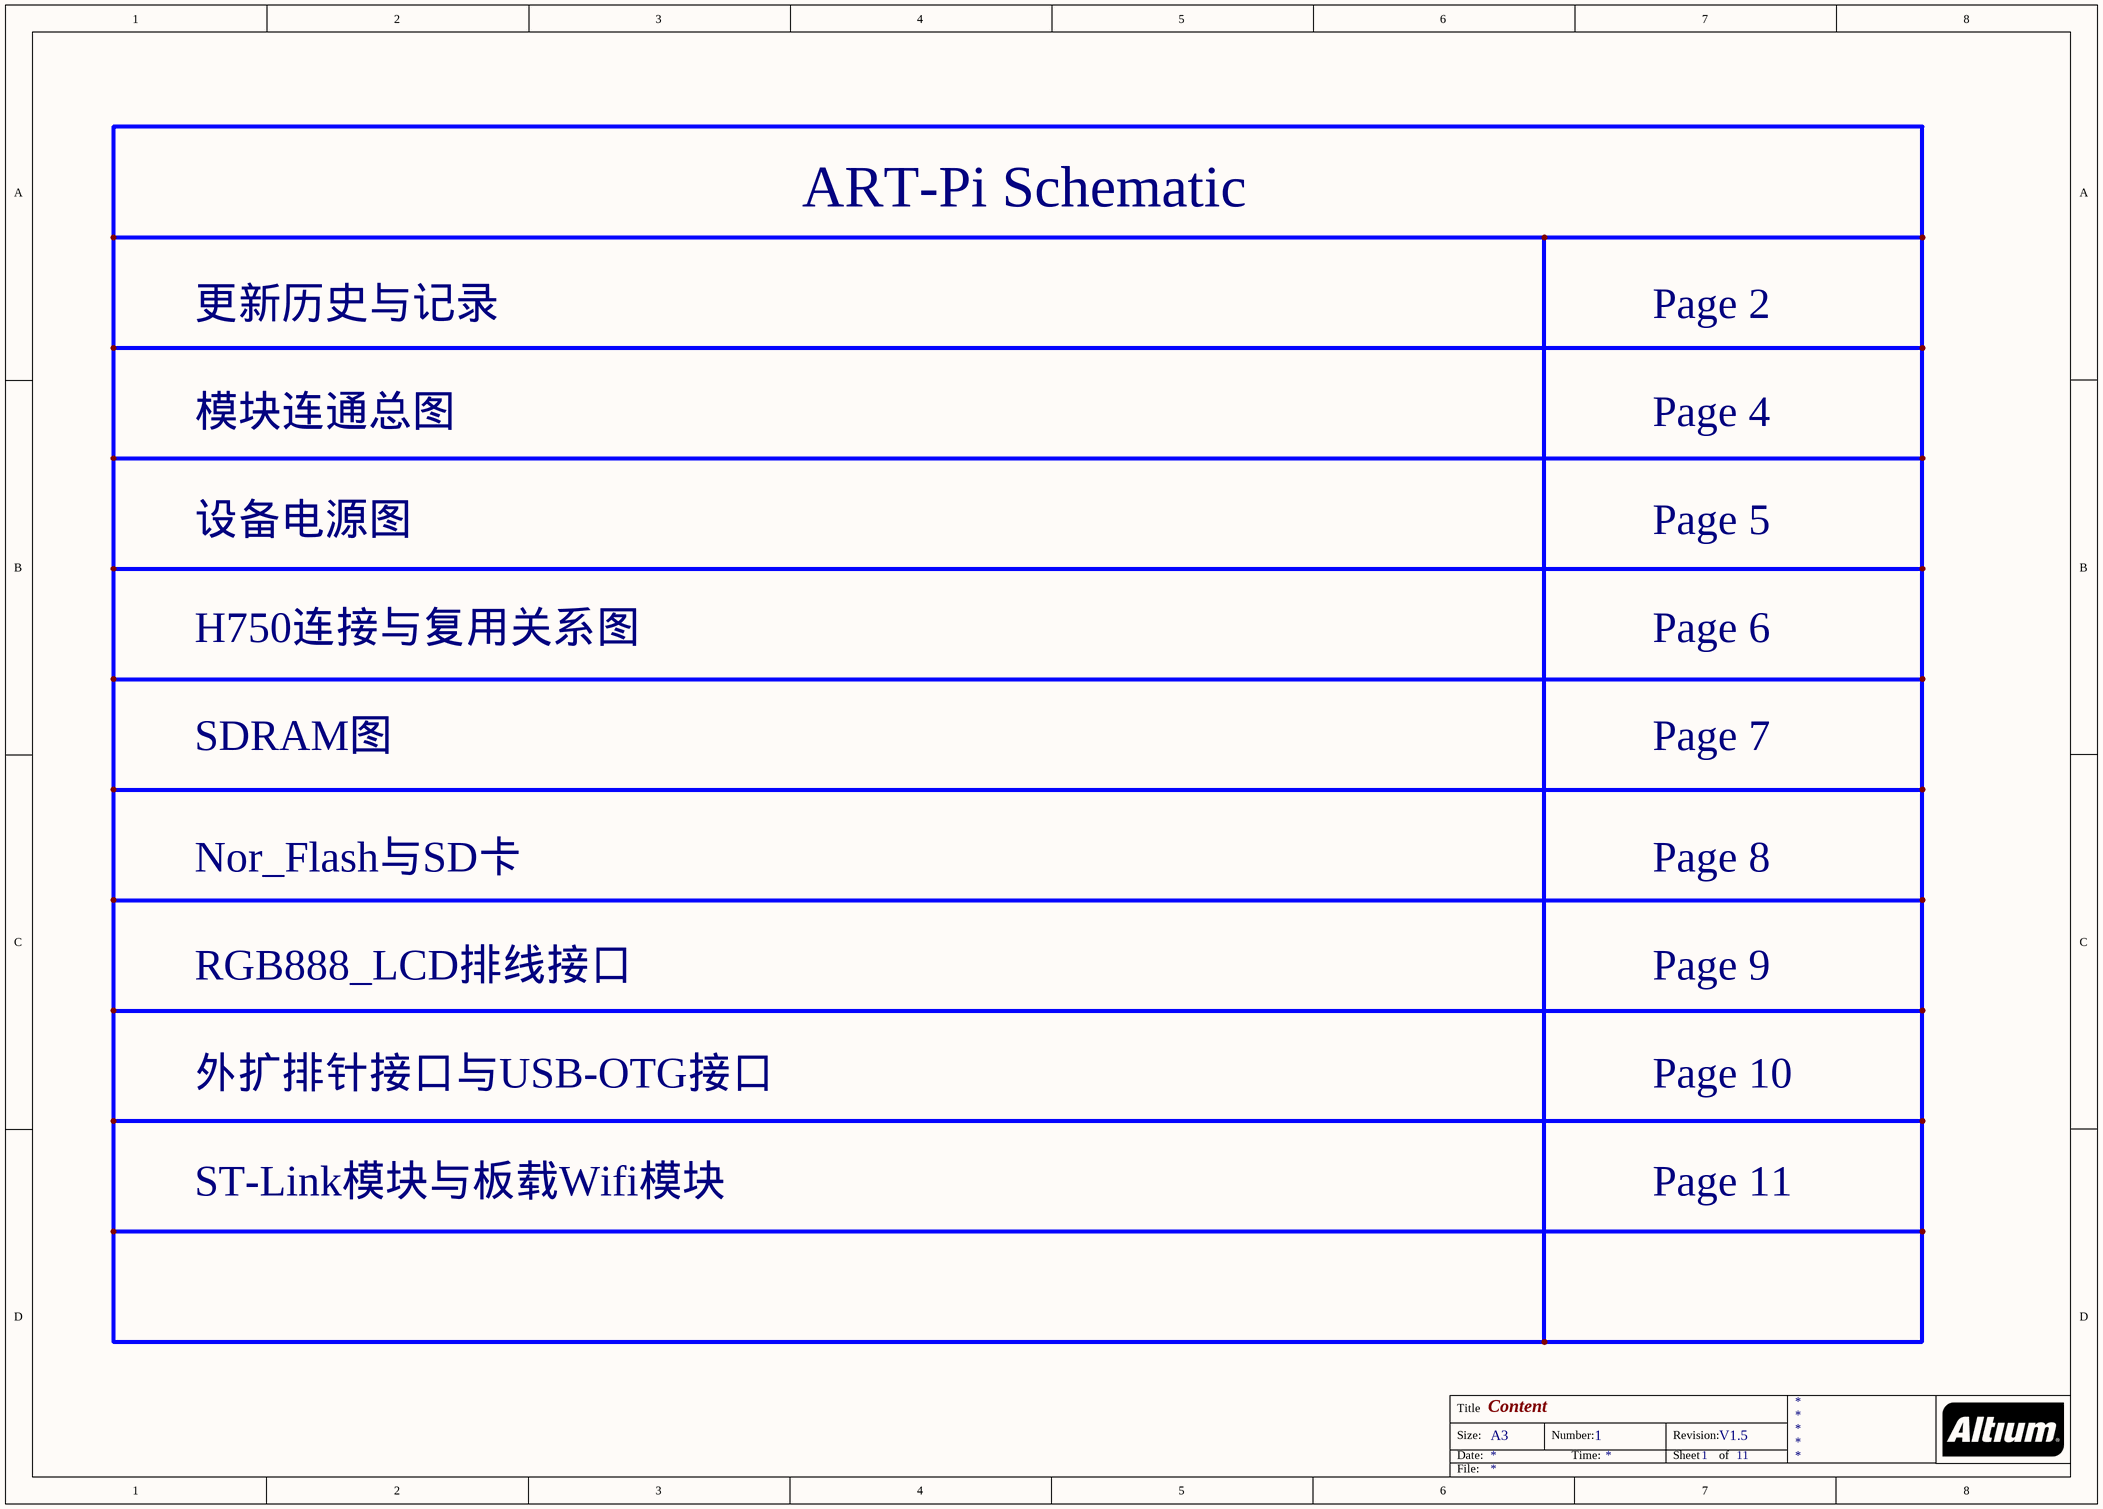
[diagram p7: ART-Pi_Content.SchDoc]

### Notes on the sheet
- ART-Pi Schematic
- 更新历史与记录
- Page 2
- 模块连通总图
- Page 4
- 设备电源图
- Page 5
- H750连接与复用关系图
- Page 6
- SDRAM图
- Page 7
- Nor_Flash与SD卡
- Page 8
- RGB888_LCD排线接口
- Page 9
- 外扩排针接口与USB-OTG接口
- Page 10
- ST-Link模块与板载Wifi模块
- Page 11
- Title
- Size:
- Date:
- A3
- Number:
- Time:
- Revision:
- Sheet
- of
- File: